# Altium project MiniPTM.PrjPcb (part 1 of 4)
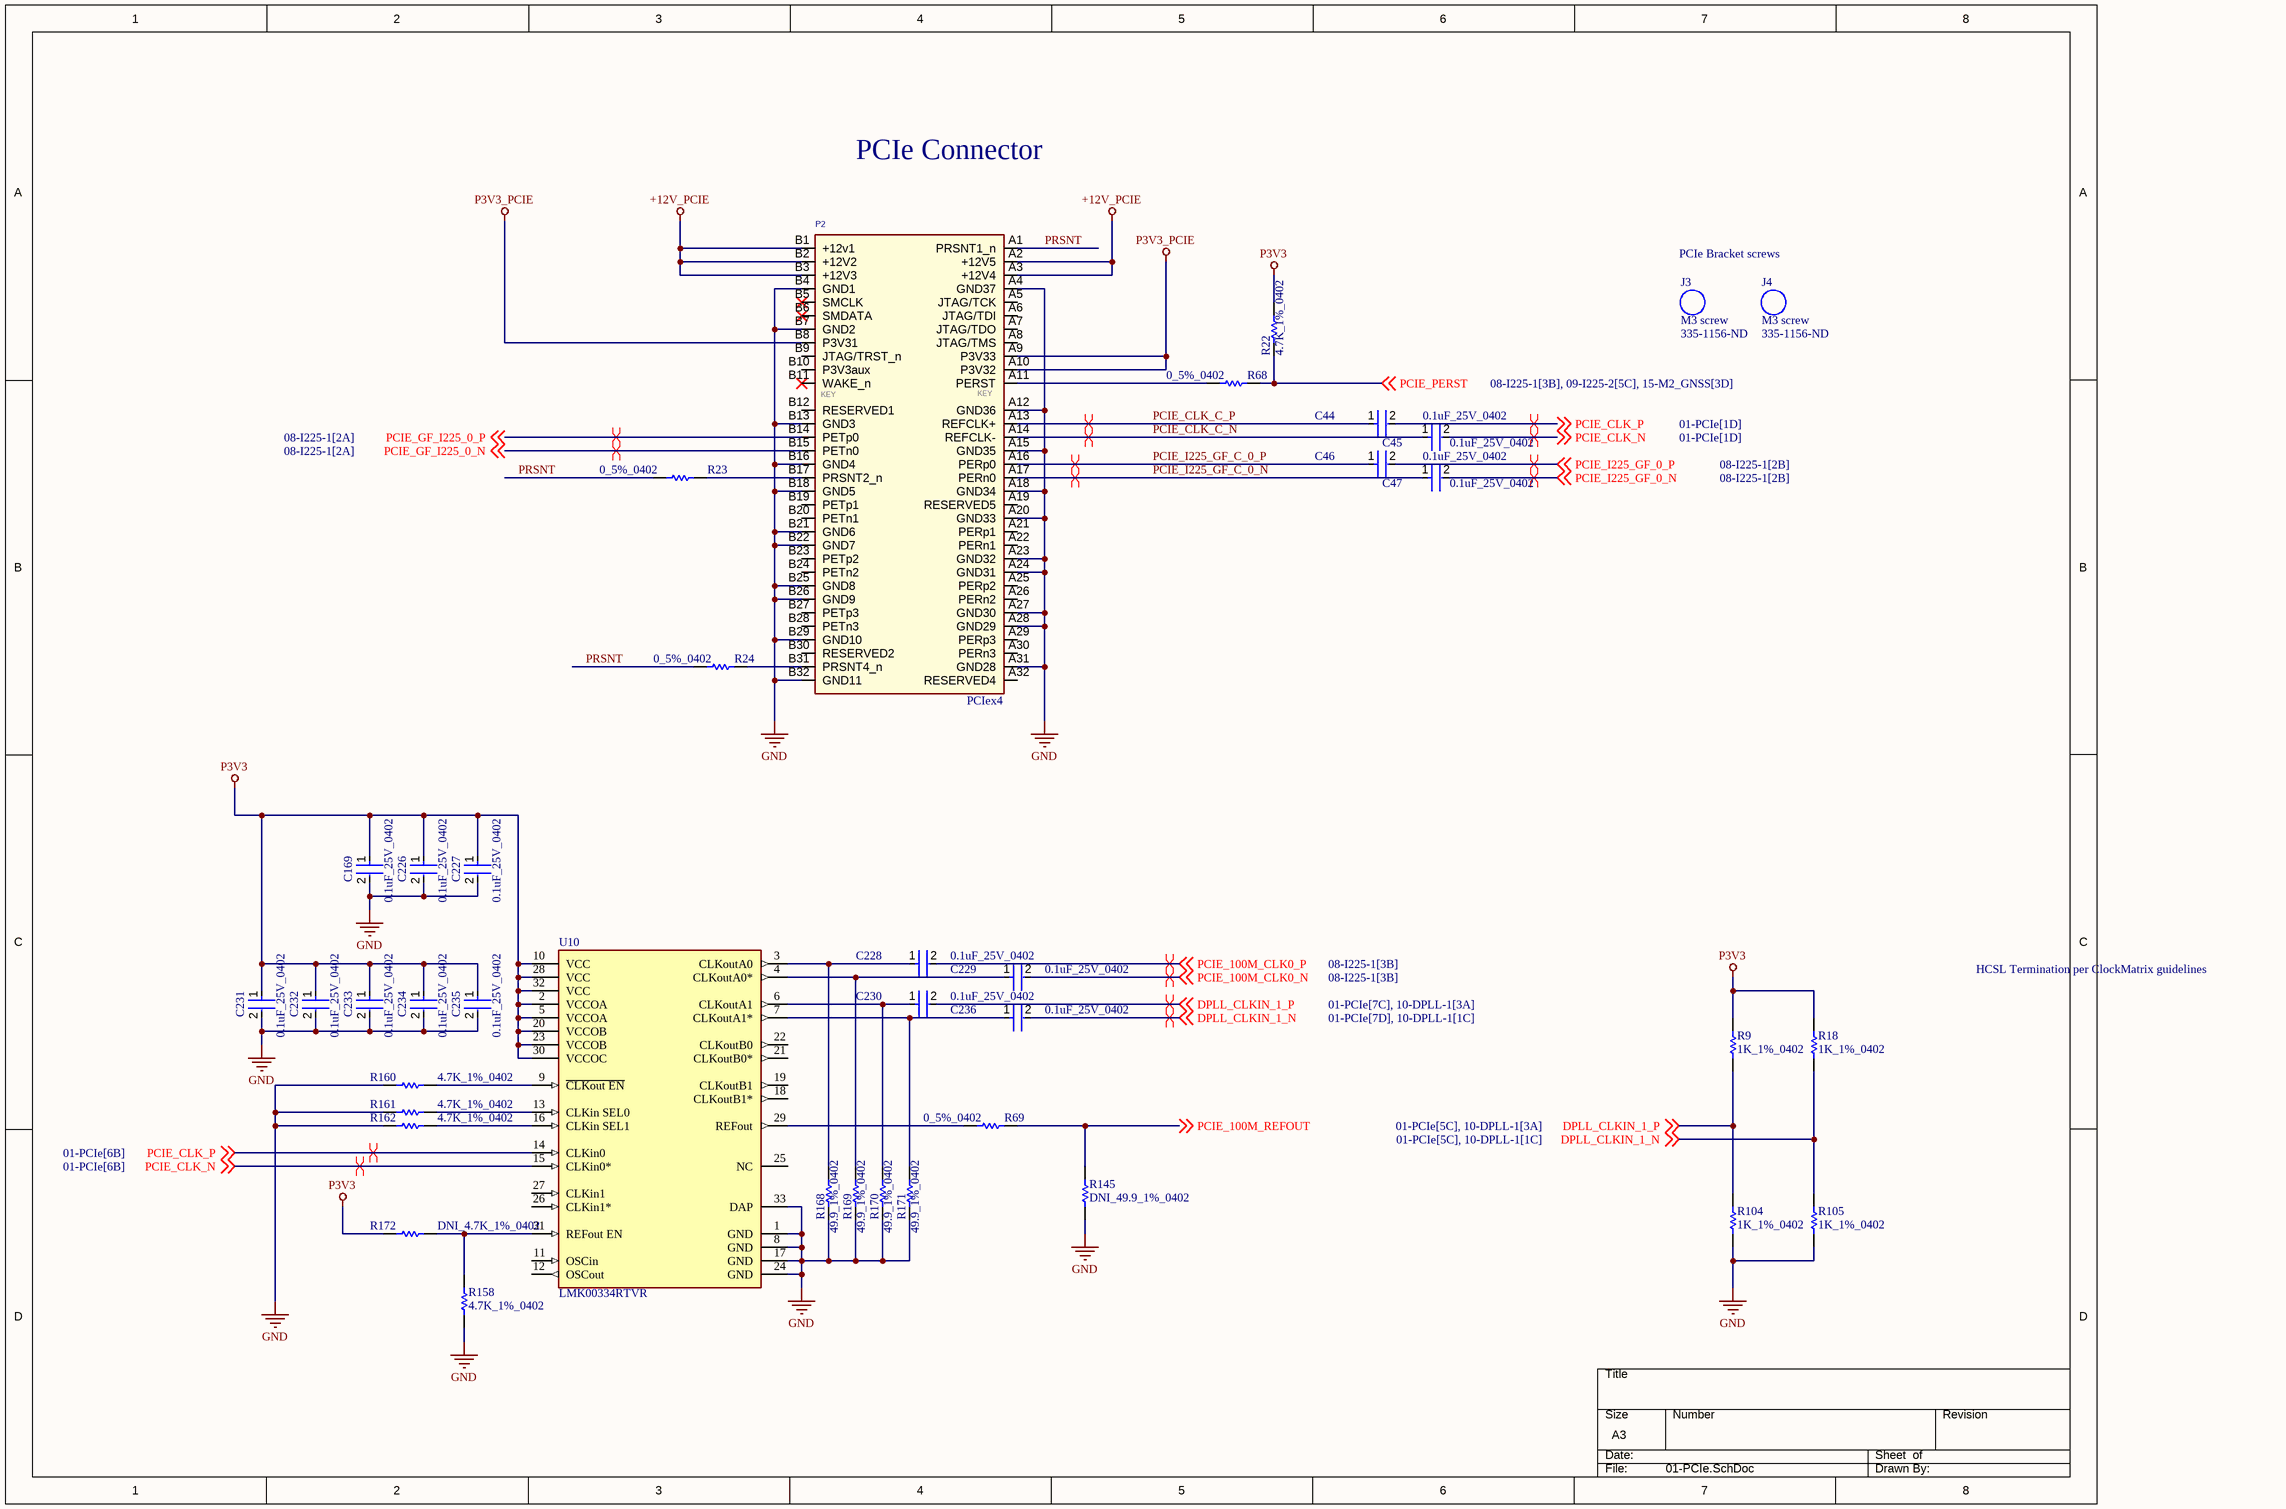
[diagram p0: 01-PCIe.SchDoc]
Revision: rev.1.0
15 sheets, 627 parts. Net scope: global (net labels, ports and power ports of the same name join across sheets).
Board file: MiniPTM.PcbDoc
Sheets:
  01-PCIe.SchDoc
  02-USER_IO.SchDoc
  03-USER_IO_STATUS.SchDoc
  05-Front Panel SFP_1.SchDoc
  06-Front Panel SFP_2.SchDoc
  07-General I2C Devices.SchDoc
  08-I225-1.SchDoc
  09-I225-2.SchDoc
  10-DPLL-1.SchDoc
  11-DPLL-2.SchDoc
  12-POWER-P12V.SchDoc
  13-Power-P3V3.SchDoc
  14-Power-P1V8.SchDoc
  15-M2_GNSS.SchDoc
  16-DPLL_Spare_UFL.SchDoc

## Sheet 01-PCIe.SchDoc
size A3; Customer: 01910; SheetNumber: 1; SheetTotal: 15

### Parts
C44  0.1uF_25V_0402  [FP-0402-L_1_0_1-W_0_5_0_1-IPC_C]
C45  0.1uF_25V_0402  [FP-0402-L_1_0_1-W_0_5_0_1-IPC_C]
C46  0.1uF_25V_0402  [FP-0402-L_1_0_1-W_0_5_0_1-IPC_C]
C47  0.1uF_25V_0402  [FP-0402-L_1_0_1-W_0_5_0_1-IPC_C]
C169  0.1uF_25V_0402  [FP-0402-L_1_0_1-W_0_5_0_1-IPC_C]
C226  0.1uF_25V_0402  [FP-0402-L_1_0_1-W_0_5_0_1-IPC_C]
C227  0.1uF_25V_0402  [FP-0402-L_1_0_1-W_0_5_0_1-IPC_C]
C228  0.1uF_25V_0402  [FP-0402-L_1_0_1-W_0_5_0_1-IPC_C]
C229  0.1uF_25V_0402  [FP-0402-L_1_0_1-W_0_5_0_1-IPC_C]
C230  0.1uF_25V_0402  [FP-0402-L_1_0_1-W_0_5_0_1-IPC_C]
C231  0.1uF_25V_0402  [FP-0402-L_1_0_1-W_0_5_0_1-IPC_C]
C232  0.1uF_25V_0402  [FP-0402-L_1_0_1-W_0_5_0_1-IPC_C]
C233  0.1uF_25V_0402  [FP-0402-L_1_0_1-W_0_5_0_1-IPC_C]
C234  0.1uF_25V_0402  [FP-0402-L_1_0_1-W_0_5_0_1-IPC_C]
C235  0.1uF_25V_0402  [FP-0402-L_1_0_1-W_0_5_0_1-IPC_C]
C236  0.1uF_25V_0402  [FP-0402-L_1_0_1-W_0_5_0_1-IPC_C]
J3  M3 screw  Supplier Part Number 1: 335-1156-ND  (no BOM)
J4  M3 screw  Supplier Part Number 1: 335-1156-ND  (no BOM)
P2  PCIex4  [PCIE_4LANE_EDGE]  (no BOM)
R9  1K_1%_0402  [RESC1005X40X25NL05T05]
R18  1K_1%_0402  [RESC1005X40X25NL05T05]
R22  4.7K_1%_0402  [RESC1005X40X25NL10T10]
R23  0_5%_0402  [RESC1005X40X25LL10T10]
R24  0_5%_0402  [RESC1005X40X25LL10T10]
R68  0_5%_0402  [RESC1005X40X25LL10T10]
R69  0_5%_0402  [RESC1005X40X25LL10T10]
R104  1K_1%_0402  [RESC1005X40X25NL05T05]
R105  1K_1%_0402  [RESC1005X40X25NL05T05]
R145  DNI_49.9_1%_0402  [RESC1005X40X25NL10T10]  (no BOM)
R158  4.7K_1%_0402  [RESC1005X40X25NL10T10]
R160  4.7K_1%_0402  [RESC1005X40X25NL10T10]
R161  4.7K_1%_0402  [RESC1005X40X25NL10T10]
R162  4.7K_1%_0402  [RESC1005X40X25NL10T10]
R168  49.9_1%_0402  [RESC1005X40X25NL10T10]
R169  49.9_1%_0402  [RESC1005X40X25NL10T10]
R170  49.9_1%_0402  [RESC1005X40X25NL10T10]
R171  49.9_1%_0402  [RESC1005X40X25NL10T10]
R172  DNI_4.7K_1%_0402  [RESC1005X40X25NL10T10]  (no BOM)
U10  LMK00334RTVR  [FP-RTV0032A-MFG]

### Nets
+12V_PCIE: P2.A2(+12V5) P2.A3(+12V4) P2.B1(+12v1) P2.B2(+12V2) P2.B3(+12V3)
GND: C169.2 C226.2 C227.2 C231.2 C232.2 C233.2 C234.2 C235.2 P2.A4(GND37) P2.A12(GND36) P2.A15(GND35) P2.A18(GND34) P2.A20(GND33) P2.A23(GND32) P2.A24(GND31) P2.A27(GND30) P2.A28(GND29) P2.A31(GND28) P2.B4(GND1) P2.B7(GND2) P2.B13(GND3) P2.B16(GND4) P2.B18(GND5) P2.B21(GND6) P2.B22(GND7) P2.B25(GND8) P2.B26(GND9) P2.B29(GND10) P2.B32(GND11) R104.1 R105.1 R145.2 R158.2 R160.2 R161.2 R162.2 R168.1 R169.1 R170.1 R171.1 U10.1(GND) U10.8(GND) U10.17(GND) U10.24(GND) U10.33(DAP)
P3V3: C169.1 C226.1 C227.1 C231.1 C232.1 C233.1 C234.1 C235.1 R9.2 R18.2 R22.2 R172.2 U10.2(VCCOA) U10.5(VCCOA) U10.10(VCC) U10.20(VCCOB) U10.23(VCCOB) U10.28(VCC) U10.30(VCCOC) U10.32(VCC)
P3V3_PCIE: P2.A9(P3V33) P2.A10(P3V32) P2.B8(P3V31)
DPLL_CLKIN_1_N: C236.2 R18.1 R105.2 ; off-sheet DPLL_CLKIN_1_N
DPLL_CLKIN_1_P: C230.2 R9.1 R104.2 ; off-sheet DPLL_CLKIN_1_P
PCIE_100M_CLK0_N: C229.2 ; off-sheet PCIE_100M_CLK0_N
PCIE_100M_CLK0_P: C228.2 ; off-sheet PCIE_100M_CLK0_P
PCIE_100M_REFOUT: R69.2 R145.1 ; off-sheet PCIE_100M_REFOUT
PCIE_CLK_C_N: C45.1 P2.A14(REFCLK-)
PCIE_CLK_C_P: C44.1 P2.A13(REFCLK+)
PCIE_CLK_N: C45.2 U10.15(CLKin0*) ; off-sheet PCIE_CLK_N
PCIE_CLK_P: C44.2 U10.14(CLKin0) ; off-sheet PCIE_CLK_P
PCIE_GF_I225_0_N: P2.B15(PETn0) ; off-sheet PCIE_GF_I225_0_N
PCIE_GF_I225_0_P: P2.B14(PETp0) ; off-sheet PCIE_GF_I225_0_P
PCIE_I225_GF_0_N: C47.2 ; off-sheet PCIE_I225_GF_0_N
PCIE_I225_GF_0_P: C46.2 ; off-sheet PCIE_I225_GF_0_P
PCIE_I225_GF_C_0_N: C47.1 P2.A17(PERn0)
PCIE_I225_GF_C_0_P: C46.1 P2.A16(PERp0)
PCIE_PERST: R22.1 R68.2 ; off-sheet PCIE_PERST
PRSNT: P2.A1(PRSNT1_n) R23.1 R24.1
NetC228_1: C228.1 R168.2 U10.3(CLKoutA0)
NetC229_1: C229.1 R169.2 U10.4(CLKoutA0*)
NetC230_1: C230.1 R170.2 U10.6(CLKoutA1)
NetC236_1: C236.1 R171.2 U10.7(CLKoutA1*)
NetP2_A11: P2.A11(PERST) R68.1
NetP2_B17: P2.B17(PRSNT2_n) R23.2
NetP2_B31: P2.B31(PRSNT4_n) R24.2
NetR69_1: R69.1 U10.29(REFout)
NetR158_1: R158.1 R172.1 U10.31(REFout_EN)
NetR160_1: R160.1 U10.9(~{CLKout_EN})
NetR161_1: R161.1 U10.13(CLKin_SEL0)
NetR162_1: R162.1 U10.16(CLKin_SEL1)

Not connected (* = marked no-connect by the designer): P2 A5(JTAG/TCK) A6(JTAG/TDI) A7(JTAG/TDO) A8(JTAG/TMS) A19(RESERVED5) A21(PERp1) A22(PERn1) A25(PERp2) A26(PERn2) A29(PERp3) A30(PERn3) A32(RESERVED4) B5(SMCLK)* B6(SMDATA)* B9(JTAG/TRST_n) B10(P3V3aux) B11(WAKE_n)* B12(RESERVED1) B19(PETp1) B20(PETn1) B23(PETp2) B24(PETn2) B27(PETp3) B28(PETn3) B30(RESERVED2); U10 11(OSCin) 12(OSCout) 18(CLKoutB1*) 19(CLKoutB1) 21(CLKoutB0*) 22(CLKoutB0) 25(NC) 26(CLKin1*) 27(CLKin1)

### Layout directives
differential pair: DPLL_CLKIN_1_N, DPLL_CLKIN_1_P, PCIE_100M_CLK0_N, PCIE_100M_CLK0_P, PCIE_CLK_C_N, PCIE_CLK_C_P, PCIE_CLK_N, PCIE_CLK_P, PCIE_GF_I225_0_N, PCIE_GF_I225_0_P, PCIE_I225_GF_0_N, PCIE_I225_GF_0_P, PCIE_I225_GF_C_0_N, PCIE_I225_GF_C_0_P

### Notes on the sheet
- PCIe Connector
- PCIe Bracket screws
- HCSL Termination per ClockMatrix guidelines
- SHEET
- REV
- timingcard.com <http://timingcard.com>
- DATE
- OF
- (in symbol PCIex4) KEY

### Library data of the parts
C44-C47 C169 C226-C236 = CMP-2008-02519-2: General Purpose Ceramic Capacitor, 0402, 100nF, 10%, X7R, 15%, 25V; Package Quantity: 1; Capacitance: 100nF; Min Operating Temperature: -55°C; Voltage: 25V; Voltage Rating: 25V; Construction: Flat; Max Operating Temperature: 125°C; Radiation Hardening: No; Depth: 0.5mm; Thickness: 0.022inch; Voltage Rating (DC): 25V; Number of Pins: 2; Lead Free: Lead Free; Series: -; REACH SVHC: No SVHC; Length: 1mm; Dielectric: X7R; RoHS Compliant: Yes; Mount: Surface Mount; Packaging: Tape and Reel; Case/Package: 0402; Case Code (Imperial): 0402; Termination: SMD/SMT; Width: 0.02inch; Case Code (Metric): 1005; Tolerance: 10%
P2 = PCIex4: PCIE x4 Edge Connector,OrCAD Symbol,NC; Part Number: 451; Manufacturer: NA; NOTE: NC; Vendor P/N: NA; Part Type: SMT
R9 R18 R104 R105 = CMP-2002-08277-1: Manufacturer: Vishay Dale; Part Number: CRCW04021K00FKTD
R22 R158 R160-R162 R172 = CMP-2002-05217-1: Manufacturer: Bourns; Part Number: CR0402-FX-4701GLF
R23 R24 R68 R69 = CMP-2002-04569-1: Manufacturer: KOA Speer; Part Number: RK73Z1ETTP
R145 R168-R171 = CMP-2002-04448-1: Part Number: RK73H1ETTP49R9F; Manufacturer: KOA Speer
U10 = CMP-04855-000011-1: IC CLK BUF 400MHZ 1CIRC 32WQFN; Number of Outputs: 4; Max Supply Voltage: 3.45V; PLL: No; Max Duty Cycle: 55%; Operating Supply Current: 13.5mA; Min Supply Voltage: 3.15V; Nominal Supply Current: 8.5mA; Input: Crystal; Propagation Delay: 2700ps; Operating Supply Voltage: 3.3V; Number of Circuits: 1; REACH SVHC: No SVHC; Radiation Hardening: No; RoHS Compliant: Yes; Lead Free: Lead Free; Mount: Surface Mount; Min Operating Temperature: -40°C; Package Quantity: 1000; Max Operating Temperature: 85°C; Number of Pins: 32; Max Frequency: 400MHz; Frequency: 400MHz; Packaging: Tape and Reel
J3 J4 = M3 screw: Supplier 1: Digi-Key

## Sheet 02-USER_IO.SchDoc
size A3; DocumentNumber: 1; SheetNumber: 2; SheetTotal: 15
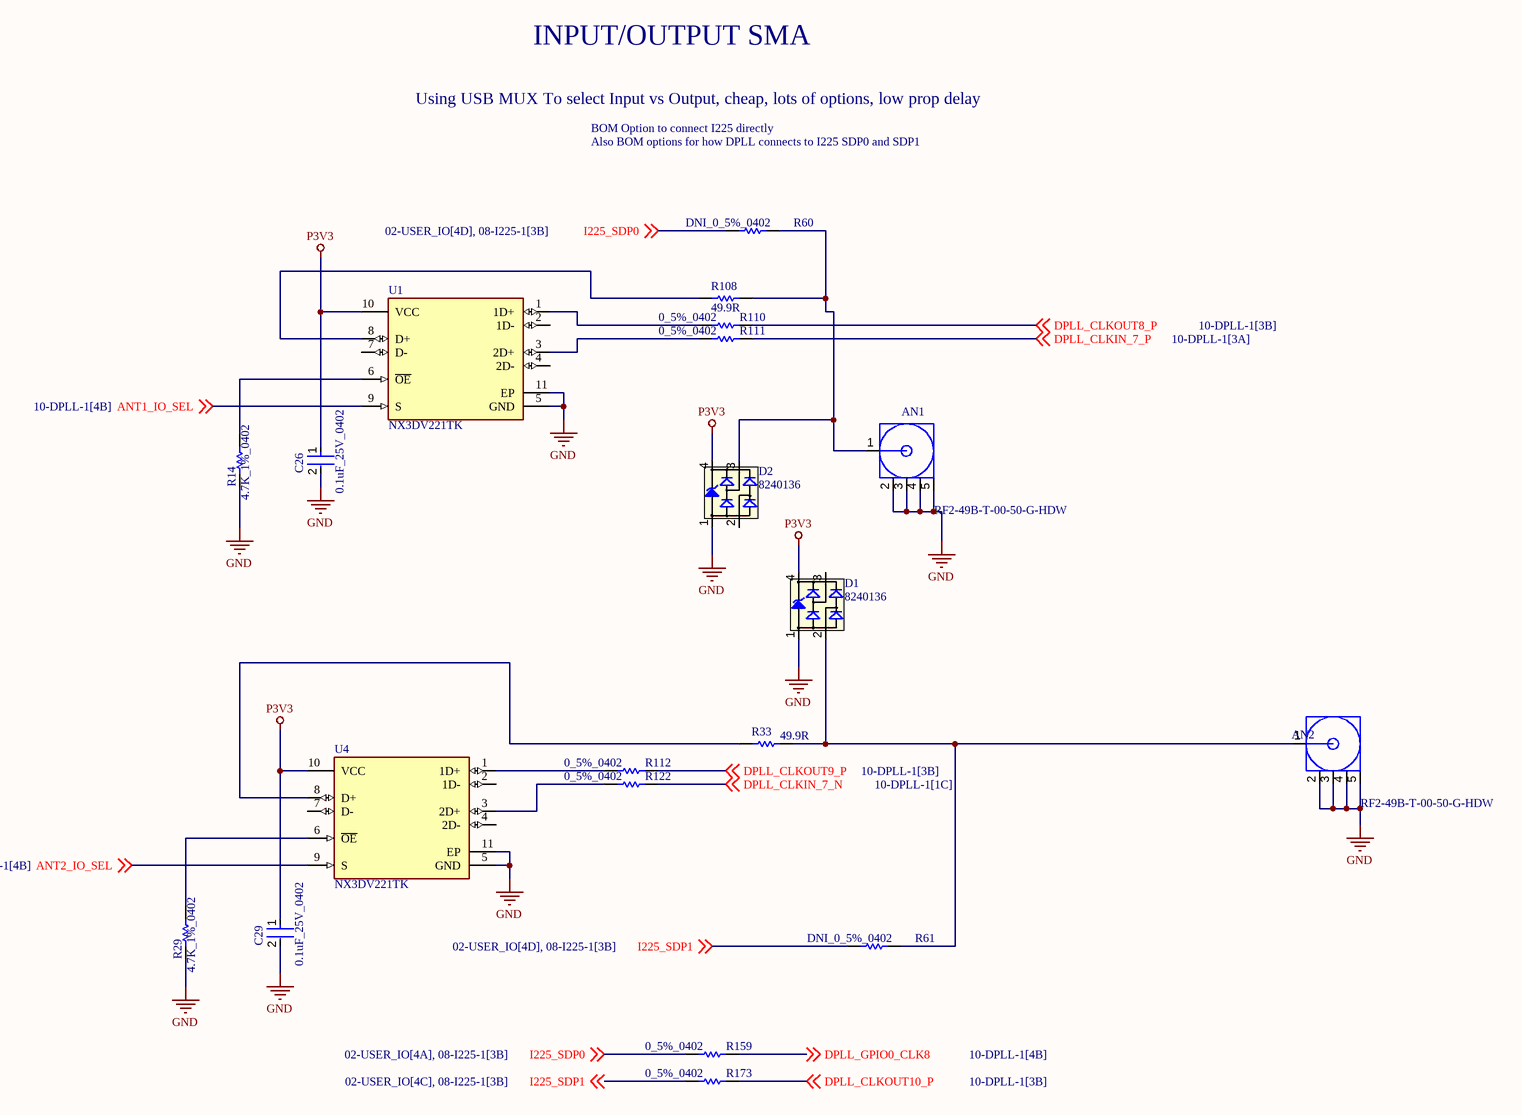
[diagram p1: 02-USER_IO.SchDoc]

### Parts
AN1  RF2-49B-T-00-50-G-HDW  [RF249BT0050GHDW]
AN2  RF2-49B-T-00-50-G-HDW  [RF249BT0050GHDW]
C26  0.1uF_25V_0402  [FP-0402-L_1_0_1-W_0_5_0_1-IPC_C]
C29  0.1uF_25V_0402  [FP-0402-L_1_0_1-W_0_5_0_1-IPC_C]
D1  8240136  [SOT143-4L]
D2  8240136  [SOT143-4L]
R14  4.7K_1%_0402  [RESC1005X40X25NL10T10]
R29  4.7K_1%_0402  [RESC1005X40X25NL10T10]
R33  49.9R  [RESC1608X55X25NL10T15]
R60  DNI_0_5%_0402  [RESC1005X40X25LL10T10]  (no BOM)
R61  DNI_0_5%_0402  [RESC1005X40X25LL10T10]  (no BOM)
R108  49.9R  [RESC1608X55X25NL10T15]
R110  0_5%_0402  [RESC1005X40X25LL10T10]
R111  0_5%_0402  [RESC1005X40X25LL10T10]
R112  0_5%_0402  [RESC1005X40X25LL10T10]
R122  0_5%_0402  [RESC1005X40X25LL10T10]
R159  0_5%_0402  [RESC1005X40X25LL10T10]
R173  0_5%_0402  [RESC1005X40X25LL10T10]
U1  NX3DV221TK  [FP-SOT650-2-MFG]
U4  NX3DV221TK  [FP-SOT650-2-MFG]

### Nets
GND: AN1.2 AN1.3 AN1.4 AN1.5 AN2.2 AN2.3 AN2.4 AN2.5 C26.2 C29.2 D1.1(GND) D2.1(GND) R14.2 R29.2 U1.5(GND) U1.11(EP) U4.5(GND) U4.11(EP)
P3V3: C26.1 C29.1 D1.4(VDD) D2.4(VDD) U1.10(VCC) U4.10(VCC)
ANT1_IO_SEL: U1.9(S) ; off-sheet ANT1_IO_SEL
ANT2_IO_SEL: U4.9(S) ; off-sheet ANT2_IO_SEL
DPLL_CLKIN_7_N: R122.2 ; off-sheet DPLL_CLKIN_7_N
DPLL_CLKIN_7_P: R111.2 ; off-sheet DPLL_CLKIN_7_P
DPLL_CLKOUT8_P: R110.2 ; off-sheet DPLL_CLKOUT8_P
DPLL_CLKOUT9_P: R112.2 ; off-sheet DPLL_CLKOUT9_P
DPLL_CLKOUT10_P: R173.2 ; off-sheet DPLL_CLKOUT10_P
DPLL_GPIO0_CLK8: R159.2 ; off-sheet DPLL_GPIO0_CLK8
I225_SDP0: R60.1 R159.1 ; off-sheet I225_SDP0
I225_SDP1: R61.1 R173.1 ; off-sheet I225_SDP1
NetAN1_1: AN1.1 D2.3(I/O2) R60.2 R108.1
NetAN2_1: AN2.1 D1.2(I/O1) R33.2 R61.2
NetR14_1: R14.1 U1.6(~{OE})
NetR29_1: R29.1 U4.6(~{OE})
NetR33_1: R33.1 U4.8(D+)
NetR108_2: R108.2 U1.8(D+)
NetR110_1: R110.1 U1.1(1D+)
NetR111_1: R111.1 U1.3(2D+)
NetR112_1: R112.1 U4.1(1D+)
NetR122_1: R122.1 U4.3(2D+)

Not connected (* = marked no-connect by the designer): D1 3(I/O2); D2 2(I/O1); U1 2(1D-) 4(2D-) 7(D-); U4 2(1D-) 4(2D-) 7(D-)

### Notes on the sheet
- Using USB MUX To select Input vs Output, cheap, lots of options, low prop delay
- INPUT/OUTPUT SMA
- BOM Option to connect I225 directly
- Also BOM options for how DPLL connects to I225 SDP0 and SDP1
- SHEET
- REV
- timingcard.com <http://timingcard.com>
- DATE
- OF

### Library data of the parts
AN1 AN2 = RF2-49B-T-00-50-G-HDW: Connector; Manufacturer_Name: Adam Tech; Datasheet Link: https://www.digikey.com/en/products/detail/adam-tech/RF2-49B-T-00-50-G-HDW/9831420?msockid=3e3afa68a50969ca3057ef1ca4c9684b; Height: 10.958mm; Manufacturer_Part_Number: RF2-49B-T-00-50-G-HDW; Arrow Part Number: RF2-49B-T-00-50-G-HDW; Arrow Price/Stock: https://www.arrow.com/en/products/rf2-49b-t-00-50-g-hdw/adam-tech?region=nac
C26 C29 = CMP-2008-02519-2: as C44 on sheet 01-PCIe; Package Quantity: 1; Capacitance: 100nF; Min Operating Temperature: -55°C; Voltage: 25V; Voltage Rating: 25V; Construction: Flat; Max Operating Temperature: 125°C; Radiation Hardening: No; Depth: 0.5mm; Thickness: 0.022inch; Voltage Rating (DC): 25V; Number of Pins: 2; Lead Free: Lead Free; Series: -; REACH SVHC: No SVHC; Length: 1mm; Dielectric: X7R; RoHS Compliant: Yes; Mount: Surface Mount; Packaging: Tape and Reel; Case/Package: 0402; Case Code (Imperial): 0402; Termination: SMD/SMT; Width: 0.02inch; Case Code (Metric): 1005; Tolerance: 10%
D1 D2 = CMP-1486-00002-1: TVS Diode WE-TVS-HS, VRWM=3.3V; Manufacturer: Wuerth Elektronik; Reverse Stand Off Voltage: 3.3V; PartNumber: 8240136; ComponentLink1Description: Manufacturer URL; PackageReference: SOT143-4L; ComponentLink1URL: http://www.we-online.com; ComponentLink2Description: Datasheet; ComponentLink2URL: http://katalog.we-online.de/kataloge/eisos/media/pdf/8240136.pdf
R14 R29 = CMP-2002-05217-1: as R22 on sheet 01-PCIe
R33 R108 = CMP-1659-00036-1: General Purpose Chip Resistor, 49.9 Ohm, +/- 1%, -55 to 155 degC, 0603 (1608 Metric), RoHS, Tape and Reel; Max Supply Voltage: 3.63 V; Case\Package: LQFP; Interface: SPI; Min Supply Voltage: 2.97 V; PackageReference: 0603; Packaging: Tray; ComponentLink2Description: Datasheet; ComponentLink1Description: Manufacturer URL; ComponentLink2URL: https://datasheet.ciiva.com/11808/0900766b80f96399-11808223.pdf; RoHSCompliant: true; Max Operating Temperature: 85 degC; ComponentLink1URL: http://www.yageo.com/; PackageDescription: 2-Pin Surface Mount Device, Body 1.6 x 0.8 mm; DatasheetVersion: Rev. 4, 04/2009; Min Operating Temperature: -40 degC; Package Quantity: 250; Pins: 48
R60 R61 R110-R112 R122 R159 R173 = CMP-2002-04569-1: as R23 on sheet 01-PCIe
U1 U4 = CMP-10103-000005-1: USB Switch IC 1 Channel 10-HVSON (3x3); RoHS Compliant: Yes

## Sheet 03-USER_IO_STATUS.SchDoc: Time Card
size A4; SheetNumber: 3; SheetTotal: 15; ENG_APP_DATE: --/--/--; DSN_APP_DATE: --/--/--; CHK_APP_DATE: --/--/--
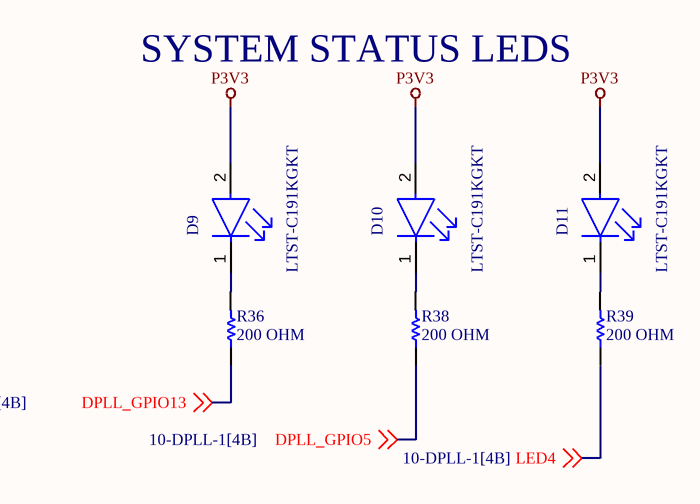
[diagram p2: 03-USER_IO_STATUS.SchDoc]

### Parts
D9  LTST-C191KGKT  [FP-LTST-C191KGKT-MFG]
D10  LTST-C191KGKT  [FP-LTST-C191KGKT-MFG]
D11  LTST-C191KGKT  [FP-LTST-C191KGKT-MFG]
R36  200 OHM  [RESC1608X55X30NL15T15]
R38  200 OHM  [RESC1608X55X30NL15T15]
R39  200 OHM  [RESC1608X55X30NL15T15]

### Nets
P3V3: D9.2(A) D10.2(A) D11.2(A)
DPLL_GPIO5: R38.1 ; off-sheet DPLL_GPIO5
DPLL_GPIO13: R36.1 ; off-sheet DPLL_GPIO13
LED4: R39.1 ; off-sheet LED4
NetD9_1: D9.1(C) R36.2
NetD10_1: D10.1(C) R38.2
NetD11_1: D11.1(C) R39.2

### Notes on the sheet
- SYSTEM STATUS LEDS
- DWG. NO.
- REV.
- SHT.
- THIS DOCUMENT AND THE DATA DISCLOSED HEREIN OR HEREWITH IS THE PROPERTY OF ALTIUM LIMITED AND MAY BE FREELY DISTRIBUTED IN WHOLE. NO RIGHTS ARE RESERVED OR EXPRESS OR IMPLIED WARANTEE GIVEN.
- REVISION
- DESCRIPTION
- DATE
- APPROVED
- ENG:
- APPROVALS
- PROJECT
- DSN:
- CHK:
- REFERENCE DOCUMENTS
- PROJECT REVISION:
- TITLE
- DOCUMENT REVISION:
- DESIGN ITEM:
- BOM:
- FAB DWG:
- PCB DWG:
- ASSY DWG:
- SCALE:
- SIZE
- B
- CAGE CODE
- FILE NAME
- DWG NO.
- SHEET
- OF
- REV

### Library data of the parts
D9-D11 = CMP-2000-05198-2: LED GREEN CLEAR SMD; Max Power Dissipation: 75mW; Forward Current: 30mA; Reverse Voltage: 5V; Lens Color: Colorless; Forward Voltage: 2V; Dominant Wavelength: 571nm; Number of LEDs: 1; Viewing Angle: 130°; Lens Style: Rectangular; Test Current: 20mA; Luminous Intensity: 35mcd; Wavelength: 574nm; Width: 0.8mm; Case Code (Imperial): 0603; Number of Pins: 2; Lead Free: Lead Free; Packaging: Tape and Reel; Package Quantity: 1; Min Operating Temperature: -55°C; Case/Package: 0603; Length: 1.6mm; Power Dissipation: 75mW; Depth: 0.8mm; Radiation Hardening: No; Mount: Surface Mount; Max Operating Temperature: 85°C; Color: Green; Power Rating: 75mW; Height: 0.55mm; Illumination Color: Green; Case Code (Metric): 1608; Lens Transparency: Clear; Number of Elements: 1
R36 R38 R39 = CMP-2000-00316-1: ERJ-3EKF2000V; Manufacturer: Panasonic; Part Number: ERJ-3EKF2000V

## Sheet 05-Front Panel SFP_1.SchDoc
size A3; Customer: 01910; SheetNumber: 4; SheetTotal: 15
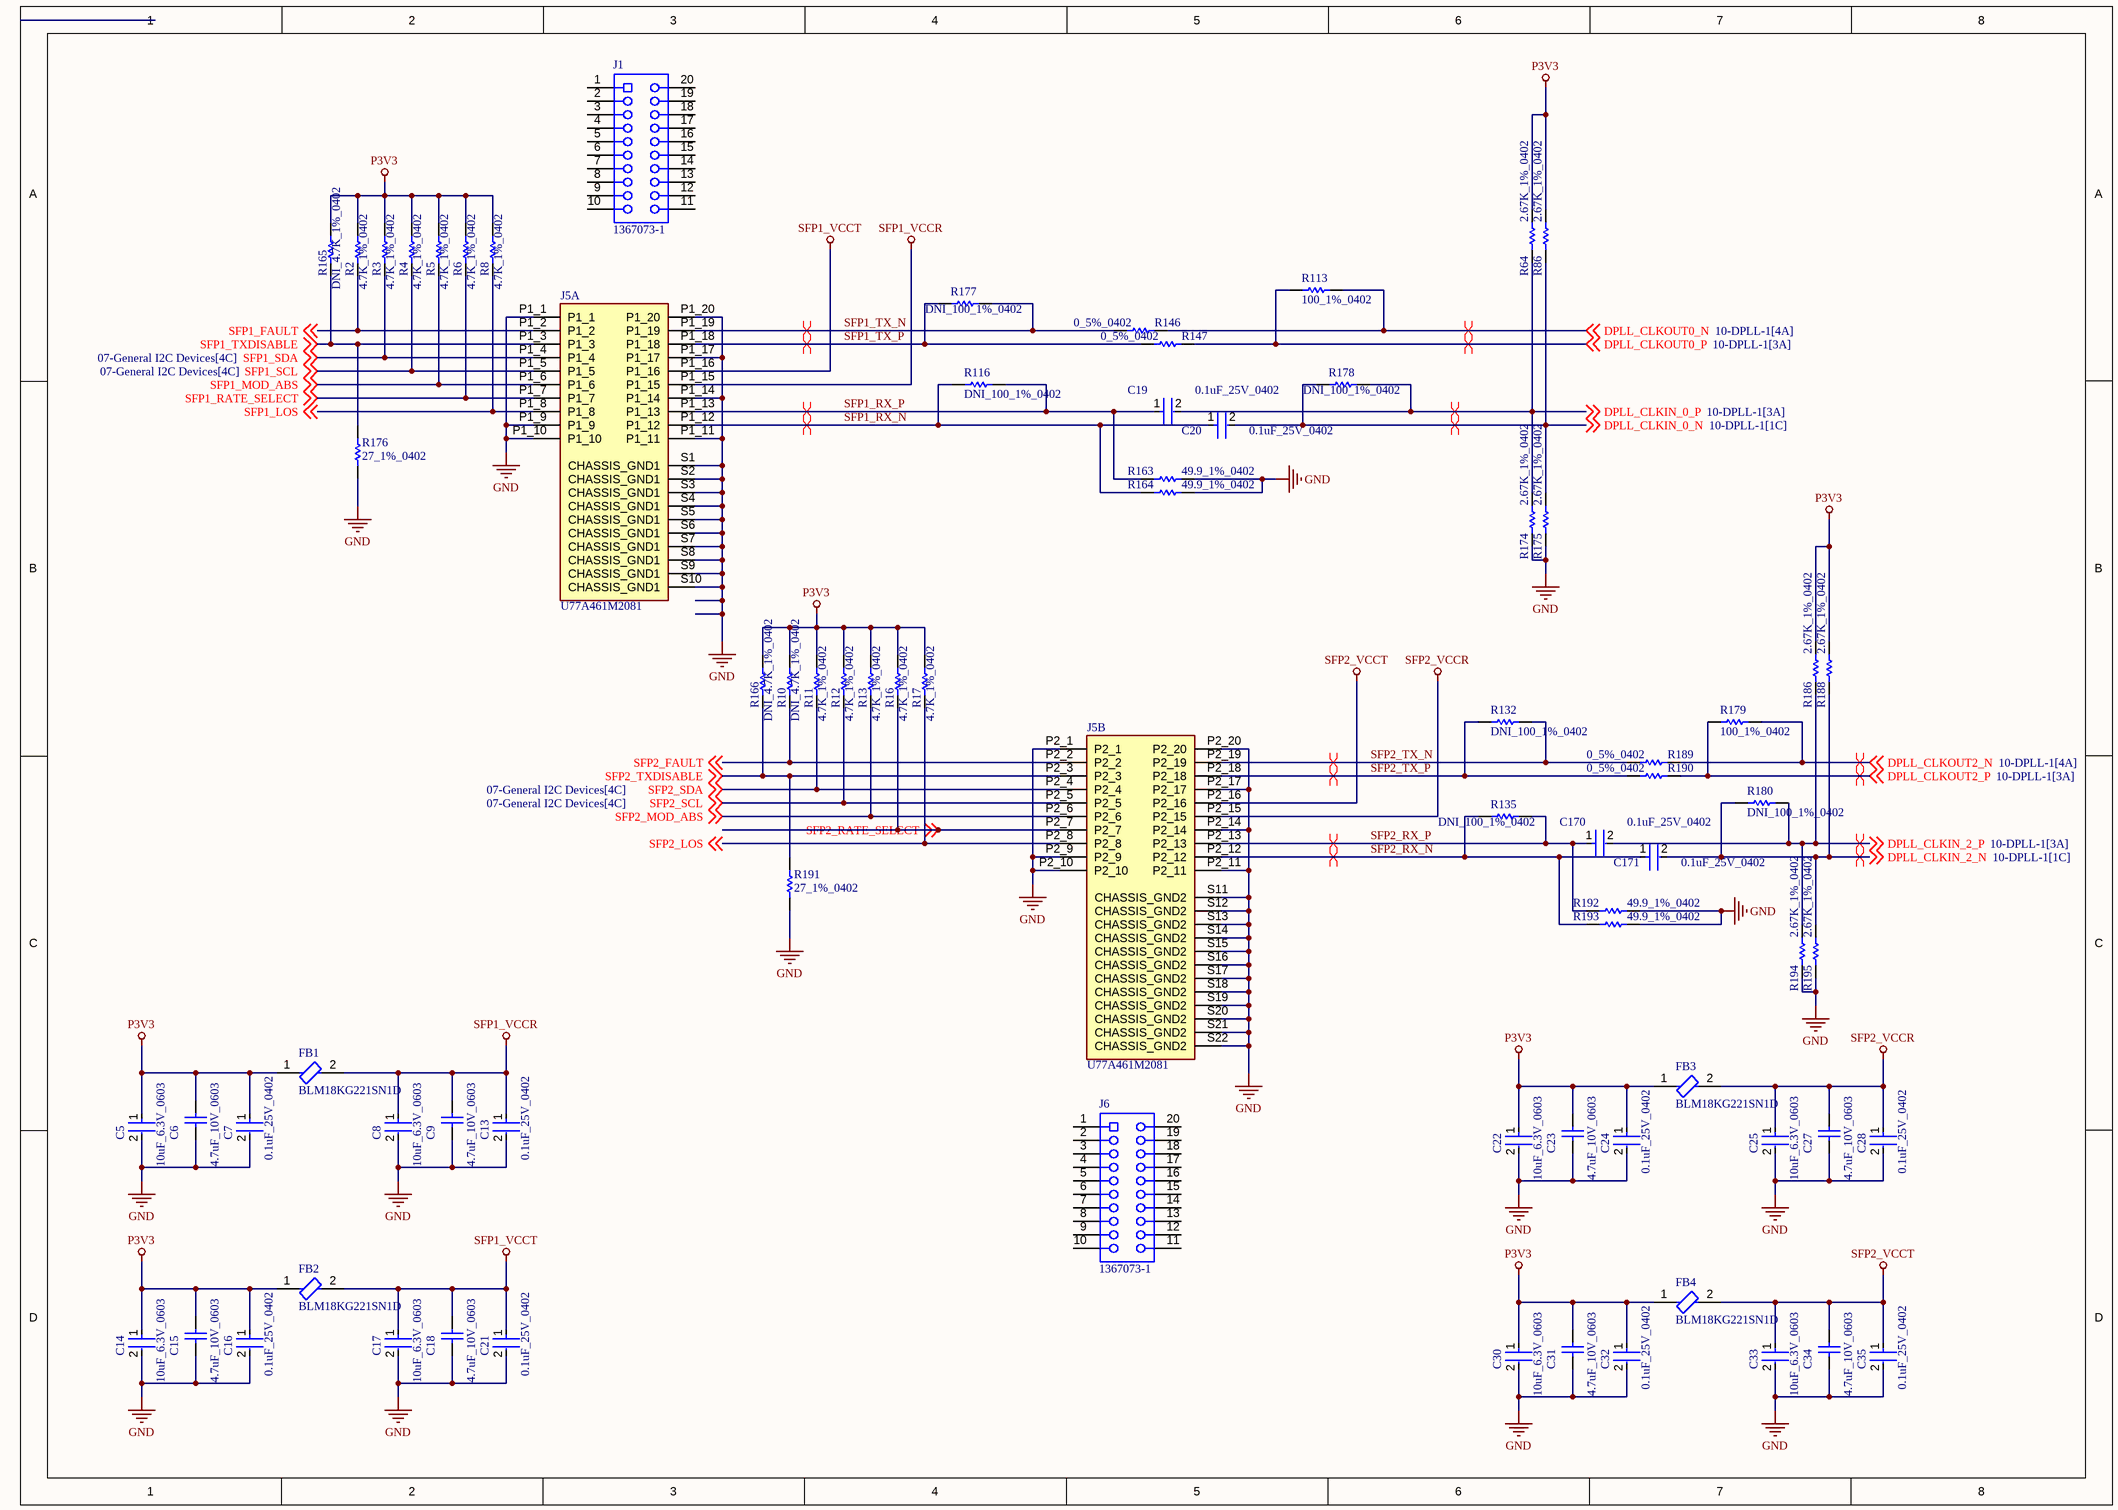
[diagram p3: 05-Front Panel SFP_1.SchDoc]

### Parts
C5  10uF_6.3V_0603  [FP-C0603C106M9PACTU-MFG]
C6  4.7uF_10V_0603  [CAPC1608X87X35NL15T15]
C7  0.1uF_25V_0402  [FP-0402-L_1_0_1-W_0_5_0_1-IPC_C]
C8  10uF_6.3V_0603  [FP-C0603C106M9PACTU-MFG]
C9  4.7uF_10V_0603  [CAPC1608X87X35NL15T15]
C13  0.1uF_25V_0402  [FP-0402-L_1_0_1-W_0_5_0_1-IPC_C]
C14  10uF_6.3V_0603  [FP-C0603C106M9PACTU-MFG]
C15  4.7uF_10V_0603  [CAPC1608X87X35NL15T15]
C16  0.1uF_25V_0402  [FP-0402-L_1_0_1-W_0_5_0_1-IPC_C]
C17  10uF_6.3V_0603  [FP-C0603C106M9PACTU-MFG]
C18  4.7uF_10V_0603  [CAPC1608X87X35NL15T15]
C19  0.1uF_25V_0402  [FP-0402-L_1_0_1-W_0_5_0_1-IPC_C]
C20  0.1uF_25V_0402  [FP-0402-L_1_0_1-W_0_5_0_1-IPC_C]
C21  0.1uF_25V_0402  [FP-0402-L_1_0_1-W_0_5_0_1-IPC_C]
C22  10uF_6.3V_0603  [FP-C0603C106M9PACTU-MFG]
C23  4.7uF_10V_0603  [CAPC1608X87X35NL15T15]
C24  0.1uF_25V_0402  [FP-0402-L_1_0_1-W_0_5_0_1-IPC_C]
C25  10uF_6.3V_0603  [FP-C0603C106M9PACTU-MFG]
C27  4.7uF_10V_0603  [CAPC1608X87X35NL15T15]
C28  0.1uF_25V_0402  [FP-0402-L_1_0_1-W_0_5_0_1-IPC_C]
C30  10uF_6.3V_0603  [FP-C0603C106M9PACTU-MFG]
C31  4.7uF_10V_0603  [CAPC1608X87X35NL15T15]
C32  0.1uF_25V_0402  [FP-0402-L_1_0_1-W_0_5_0_1-IPC_C]
C33  10uF_6.3V_0603  [FP-C0603C106M9PACTU-MFG]
C34  4.7uF_10V_0603  [CAPC1608X87X35NL15T15]
C35  0.1uF_25V_0402  [FP-0402-L_1_0_1-W_0_5_0_1-IPC_C]
C170  0.1uF_25V_0402  [FP-0402-L_1_0_1-W_0_5_0_1-IPC_C]
C171  0.1uF_25V_0402  [FP-0402-L_1_0_1-W_0_5_0_1-IPC_C]
FB1  BLM18KG221SN1D  [FP-BLM18-0_15-t0_8-IPC_B]
FB2  BLM18KG221SN1D  [FP-BLM18-0_15-t0_8-IPC_B]
FB3  BLM18KG221SN1D  [FP-BLM18-0_15-t0_8-IPC_B]
FB4  BLM18KG221SN1D  [FP-BLM18-0_15-t0_8-IPC_B]
J1  1367073-1  [TECO-1367073-1_V]
J5  U77A461M2081  [AMPHENOL_U77A461M2081]  (parts A,B of 4)
J6  1367073-1  [TECO-1367073-1_V]
R2  4.7K_1%_0402  [RESC1005X40X25NL10T10]
R3  4.7K_1%_0402  [RESC1005X40X25NL10T10]
R4  4.7K_1%_0402  [RESC1005X40X25NL10T10]
R5  4.7K_1%_0402  [RESC1005X40X25NL10T10]
R6  4.7K_1%_0402  [RESC1005X40X25NL10T10]
R8  4.7K_1%_0402  [RESC1005X40X25NL10T10]
R10  DNI_4.7K_1%_0402  [RESC1005X40X25NL10T10]  (no BOM)
R11  4.7K_1%_0402  [RESC1005X40X25NL10T10]
R12  4.7K_1%_0402  [RESC1005X40X25NL10T10]
R13  4.7K_1%_0402  [RESC1005X40X25NL10T10]
R16  4.7K_1%_0402  [RESC1005X40X25NL10T10]
R17  4.7K_1%_0402  [RESC1005X40X25NL10T10]
R64  2.67K_1%_0402  [RESC1005X40X25NL05T10]
R86  2.67K_1%_0402  [RESC1005X40X25NL05T10]
R113  100_1%_0402  [RESC1005X40X25NL05T10]
R116  DNI_100_1%_0402  [RESC1005X40X25NL05T10]  (no BOM)
R132  DNI_100_1%_0402  [RESC1005X40X25NL05T10]  (no BOM)
R135  DNI_100_1%_0402  [RESC1005X40X25NL05T10]  (no BOM)
R146  0_5%_0402  [RESC1005X40X25LL10T10]
R147  0_5%_0402  [RESC1005X40X25LL10T10]
R163  49.9_1%_0402  [RESC1005X40X25NL10T10]
R164  49.9_1%_0402  [RESC1005X40X25NL10T10]
R165  DNI_4.7K_1%_0402  [RESC1005X40X25NL10T10]  (no BOM)
R166  DNI_4.7K_1%_0402  [RESC1005X40X25NL10T10]  (no BOM)
R174  2.67K_1%_0402  [RESC1005X40X25NL05T10]
R175  2.67K_1%_0402  [RESC1005X40X25NL05T10]
R176  27_1%_0402  [RESC1005X40X25NL05T05]
R177  DNI_100_1%_0402  [RESC1005X40X25NL05T10]  (no BOM)
R178  DNI_100_1%_0402  [RESC1005X40X25NL05T10]  (no BOM)
R179  100_1%_0402  [RESC1005X40X25NL05T10]
R180  DNI_100_1%_0402  [RESC1005X40X25NL05T10]  (no BOM)
R186  2.67K_1%_0402  [RESC1005X40X25NL05T10]
R188  2.67K_1%_0402  [RESC1005X40X25NL05T10]
R189  0_5%_0402  [RESC1005X40X25LL10T10]
R190  0_5%_0402  [RESC1005X40X25LL10T10]
R191  27_1%_0402  [RESC1005X40X25NL05T05]
R192  49.9_1%_0402  [RESC1005X40X25NL10T10]
R193  49.9_1%_0402  [RESC1005X40X25NL10T10]
R194  2.67K_1%_0402  [RESC1005X40X25NL05T10]
R195  2.67K_1%_0402  [RESC1005X40X25NL05T10]

### Nets
GND: C5.2 C6.1 C7.2 C8.2 C9.1 C13.2 C14.2 C15.1 C16.2 C17.2 C18.1 C21.2 C22.2 C23.1 C24.2 C25.2 C27.1 C28.2 C30.2 C31.1 C32.2 C33.2 C34.1 C35.2 J5.P1_1 J5.P1_9 J5.P1_10 J5.P1_11 J5.P1_14 J5.P1_17 J5.P1_20 J5.P2_1 J5.P2_9 J5.P2_10 J5.P2_11 J5.P2_14 J5.P2_17 J5.P2_20 J5.S1(CHASSIS_GND1) J5.S2(CHASSIS_GND1) J5.S3(CHASSIS_GND1) J5.S4(CHASSIS_GND1) J5.S5(CHASSIS_GND1) J5.S6(CHASSIS_GND1) J5.S7(CHASSIS_GND1) J5.S8(CHASSIS_GND1) J5.S9(CHASSIS_GND1) J5.S10(CHASSIS_GND1) J5.S11(CHASSIS_GND2) J5.S12(CHASSIS_GND2) J5.S13(CHASSIS_GND2) J5.S14(CHASSIS_GND2) J5.S15(CHASSIS_GND2) J5.S16(CHASSIS_GND2) J5.S17(CHASSIS_GND2) J5.S18(CHASSIS_GND2) J5.S19(CHASSIS_GND2) J5.S20(CHASSIS_GND2) J5.S21(CHASSIS_GND2) J5.S22(CHASSIS_GND2) R163.2 R164.2 R174.1 R175.1 R176.1 R191.1 R192.2 R193.2 R194.1 R195.1
P3V3: C5.1 C6.2 C7.1 C14.1 C15.2 C16.1 C22.1 C23.2 C24.1 C30.1 C31.2 C32.1 FB1.1 FB2.1 FB3.1 FB4.1 R2.1 R3.1 R4.1 R5.1 R6.1 R8.1 R10.1 R11.1 R12.1 R13.1 R16.1 R17.1 R64.2 R86.2 R165.1 R166.1 R186.2 R188.2
SFP1_VCCR: C8.1 C9.2 C13.1 FB1.2 J5.P1_15
SFP1_VCCT: C17.1 C18.2 C21.1 FB2.2 J5.P1_16
SFP2_VCCR: C25.1 C27.2 C28.1 FB3.2 J5.P2_15
SFP2_VCCT: C33.1 C34.2 C35.1 FB4.2 J5.P2_16
DPLL_CLKIN_0_N: C20.2 R86.1 R175.2 R178.1 ; off-sheet DPLL_CLKIN_0_N
DPLL_CLKIN_0_P: C19.2 R64.1 R174.2 R178.2 ; off-sheet DPLL_CLKIN_0_P
DPLL_CLKIN_2_N: C171.2 R180.1 R188.1 R195.2 ; off-sheet DPLL_CLKIN_2_N
DPLL_CLKIN_2_P: C170.2 R180.2 R186.1 R194.2 ; off-sheet DPLL_CLKIN_2_P
DPLL_CLKOUT0_N: R113.2 R146.2 ; off-sheet DPLL_CLKOUT0_N
DPLL_CLKOUT0_P: R113.1 R147.2 ; off-sheet DPLL_CLKOUT0_P
DPLL_CLKOUT2_N: R179.2 R189.2 ; off-sheet DPLL_CLKOUT2_N
DPLL_CLKOUT2_P: R179.1 R190.2 ; off-sheet DPLL_CLKOUT2_P
SFP1_FAULT: J5.P1_2 R2.2 ; off-sheet SFP1_FAULT
SFP1_LOS: J5.P1_8 R8.2 ; off-sheet SFP1_LOS
SFP1_MOD_ABS: J5.P1_6 R5.2 ; off-sheet SFP1_MOD_ABS
SFP1_RATE_SELECT: J5.P1_7 R6.2 ; off-sheet SFP1_RATE_SELECT
SFP1_RX_N: C20.1 J5.P1_12 R116.1 R164.1
SFP1_RX_P: C19.1 J5.P1_13 R116.2 R163.1
SFP1_SCL: J5.P1_5 R4.2 ; off-sheet SFP1_SCL
SFP1_SDA: J5.P1_4 R3.2 ; off-sheet SFP1_SDA
SFP1_TX_N: J5.P1_19 R146.1 R177.2
SFP1_TX_P: J5.P1_18 R147.1 R177.1
SFP1_TXDISABLE: J5.P1_3 R165.2 R176.2 ; off-sheet SFP1_TXDISABLE
SFP2_FAULT: J5.P2_2 R10.2 ; off-sheet SFP2_FAULT
SFP2_LOS: J5.P2_8 R17.2 ; off-sheet SFP2_LOS
SFP2_MOD_ABS: J5.P2_6 R13.2 ; off-sheet SFP2_MOD_ABS
SFP2_RATE_SELECT: J5.P2_7 R16.2 ; off-sheet SFP2_RATE_SELECT
SFP2_RX_N: C171.1 J5.P2_12 R135.1 R193.1
SFP2_RX_P: C170.1 J5.P2_13 R135.2 R192.1
SFP2_SCL: J5.P2_5 R12.2 ; off-sheet SFP2_SCL
SFP2_SDA: J5.P2_4 R11.2 ; off-sheet SFP2_SDA
SFP2_TX_N: J5.P2_19 R132.2 R189.1
SFP2_TX_P: J5.P2_18 R132.1 R190.1
SFP2_TXDISABLE: J5.P2_3 R166.2 R191.2 ; off-sheet SFP2_TXDISABLE

Not connected (* = marked no-connect by the designer): J1 1 2 3 4 5 6 7 8 9 10 11 12 13 14 15 16 17 18 19 20; J6 1 2 3 4 5 6 7 8 9 10 11 12 13 14 15 16 17 18 19 20

### Layout directives
differential pair: DPLL_CLKIN_0_N, DPLL_CLKIN_0_P, DPLL_CLKIN_2_N, DPLL_CLKIN_2_P, DPLL_CLKOUT0_N, DPLL_CLKOUT0_P, DPLL_CLKOUT2_N, DPLL_CLKOUT2_P, SFP1_RX_N, SFP1_RX_P, SFP1_TX_N, SFP1_TX_P, SFP2_RX_N, SFP2_RX_P, SFP2_TX_N, SFP2_TX_P

### Notes on the sheet
- SHEET
- REV
- timingcard.com <http://timingcard.com>
- DATE
- OF

### Library data of the parts
C5 C8 C14 C17 C22 C25 C30 C33 = CMP-2006-02285-3: CAP CER 10UF 6.3V X5R 0603; Manufacturer Part Number: C0603C106M9PACTU; Manufacturer: Kemet; Material: Ceramic; Temperature Coefficient: 15%; Tolerance: 20%; Category: Cap; Height: 0.9mm; Digikey Description: CAP CER 10UF 6.3V X5R 0603; Mouser Description: In a Pack of 10, KEMET 0603 (1608M) 10µF MLCC 6.3V dc ±20% SMD C0603C106M9PACTU; Voltage Rating: 6.3V; Device Class L2: Capacitors; Temperature Range Low: -55°C; Temperature Characteristic: X5R; ComponentLink2Description: Datasheet; Ipc Land Pattern Name: CAPC16080X80; ComponentLink2URL: http://www.kemet.com/Lists/ProductCatalog/Attachments/19/KEM_C1006_X5R_SMD.pdf; Capacitance: 10uF; Temperature Range High: +85°C; Device Class L3: Ceramic Capacitors; RoHS: TRUE; Automotive: No; Value: 10uF; Temperature: -55°C to +85°C; Device Class L1: Passive Components; Package: C0603C106M9PACTU; Lead Free: Yes; Octopart: https://octopart.com/c0603c106m9pactu-kemet-8375727
C6 C9 C15 C18 C23 C27 C31 C34 = CMP-2006-03238-1: Part Number: C0603C475K8PACTU; Manufacturer: Kemet
C7 C13 C16 C19-C21 C24 C28 C32 C35 C170 C171 = CMP-2008-02519-2: as C44 on sheet 01-PCIe; Package Quantity: 1; Capacitance: 100nF; Min Operating Temperature: -55°C; Voltage: 25V; Voltage Rating: 25V; Construction: Flat; Max Operating Temperature: 125°C; Radiation Hardening: No; Depth: 0.5mm; Thickness: 0.022inch; Voltage Rating (DC): 25V; Number of Pins: 2; Lead Free: Lead Free; Series: -; REACH SVHC: No SVHC; Length: 1mm; Dielectric: X7R; RoHS Compliant: Yes; Mount: Surface Mount; Packaging: Tape and Reel; Case/Package: 0402; Case Code (Imperial): 0402; Termination: SMD/SMT; Width: 0.02inch; Case Code (Metric): 1005; Tolerance: 10%
FB1-FB4 = CMP-0686-00556-7: Chip Ferrite Bead, 0603, 220Ω @ 100MHz, 0.05Ω, 25%, 2.2A; DC Resistance (DCR): 50mR; Number of Circuits: 1; Impedance: 220R; Current Rating: 2.2A; Material: Ferrite; Test Frequency: 100MHz; Depth: 0.8mm; Series: BLM18K; RoHS Compliant: Yes; Termination: SMD/SMT; Max Current Rating: 2.2A; Case Code (Metric): 1608; Radiation Hardening: No; Number of Pins: 2; Length: 1.6mm; Lead Free: Lead Free; Package Quantity: 1; Height: 0.8mm; Core Material: Ferrite; Inductor Type: FERRITE BEAD; Min Operating Temperature: -55°C; Case/Package: 0603; Case Code (Imperial): 0603; Number of Lines: 1; Packaging: Tape and Reel; REACH SVHC: No SVHC; Max Operating Temperature: 125°C; Military Standard: Not; DC Resistance-Max: 50mR; Width: 0.8mm; DC Current: 2.2A; Max DC Current: 2.2A; Tolerance: 25%; Weight: 7.1E-05oz
J1 J6 = CMP-2000-05488-1: Female Connector, Pitch 0.8 mm, 2 x 10 Position, Height 5.4 mm, -55 to 85 degC, RoHS, Tape and Reel; Manufacturer: TE Connectivity; Product Training Modules: HighSpeedPluggableI/OSolutions; 3D Model: 1367073-1.pdf; Connector Type: SFP; Other Names: A97430DKR; Mating Products: 516-2084-ND / -TXRXOPTICALSFF1.25GBDISCSI; Dynamic Catalog: SFPConnectors; Featured Product: HighSpeedPluggableI-OSolutions; Connector Style: Receptacle; Associated Product: A103997CT-ND / -CONNSFPCAGESINGLEW/OPIPE / A103997TR-ND / -CONNSFPCAGESINGLEW/OPIPE / 1367645-3-ND / -CONNCAGE&HEATSINKSGLPORTTIN / 1367645-2-ND / -CONNCAGE&HEATSINKSGLPORTTIN / 1888424-1-ND / -CONNCAGE1X2SFPENHANCEDEMI / 1367643-1-ND / -CONNCAGESNGLPORTDBLSIDETIN / 1489962-1-ND / -CONNSFPCAGESINGLEW/OPIPE / 1367645-1-ND / -CONNCAGE&HEATSINKSGLPORTTIN / A99375-ND / -CONNSFPCAGE1X4PIN-IN-PASTE / A97412CT-ND / -CONNSFPLOWERCAGEPCB / More...; Number of Positions: 20; Package Reference: 1367073-1; Package Description: Female Connector, Pitch 0.8 mm, 2 x 10 Position, Height 5.4 mm; RoHS Information: 1367073-1StatementofCompliance; Contact Finish: Gold; Datasheet URL: http://www.te.com/commerce/DocumentDelivery/DDEController?Action=showdoc&DocId=Customer+Drawing%7F1367073%7FK%7Fpdf%7FEnglish%7FENG_CD_1367073_K.pdf%7F1367073-1; Datasheet Version: Rev. K, 12/2012; Contact Finish Thickness: 15µin(0.38µm); Category: Connectors,Interconnects; Mounting Type: SurfaceMount,RightAngle; Mounting Technology: SurfaceMount; Packaging: Digi-Reel®; Manufacturer URL: http://www.te.com/; Family: PluggableConnectors; Standard Package: 1; Termination: Solder
J5 = U77A461M2081: MF: AMPHENOL ICC / FCI; Package: None; Price: None; Value: *; MP: U77A461M2081; Availability: Unavailable
R2-R6 R8 R10-R13 R16 R17 R165 R166 = CMP-2002-05217-1: as R22 on sheet 01-PCIe
R64 R86 R174 R175 R186 R188 R194 R195 = CMP-2002-07574-1: Manufacturer: Yageo; Part Number: RC0402FR-072K67L
R113 R116 R132 R135 R177-R180 = CMP-2002-07853-1: Manufacturer: Yageo; Part Number: RC0402FR-13100RL
R146 R147 R189 R190 = CMP-2002-04569-1: as R23 on sheet 01-PCIe
R163 R164 R192 R193 = CMP-2002-04448-1: as R145 on sheet 01-PCIe
R176 R191 = CMP-2002-08434-1: Part Number: CRCW040227R0FKED; Manufacturer: Vishay Dale

## Sheet 06-Front Panel SFP_2.SchDoc
size B; SheetNumber: 5; SheetTotal: 15
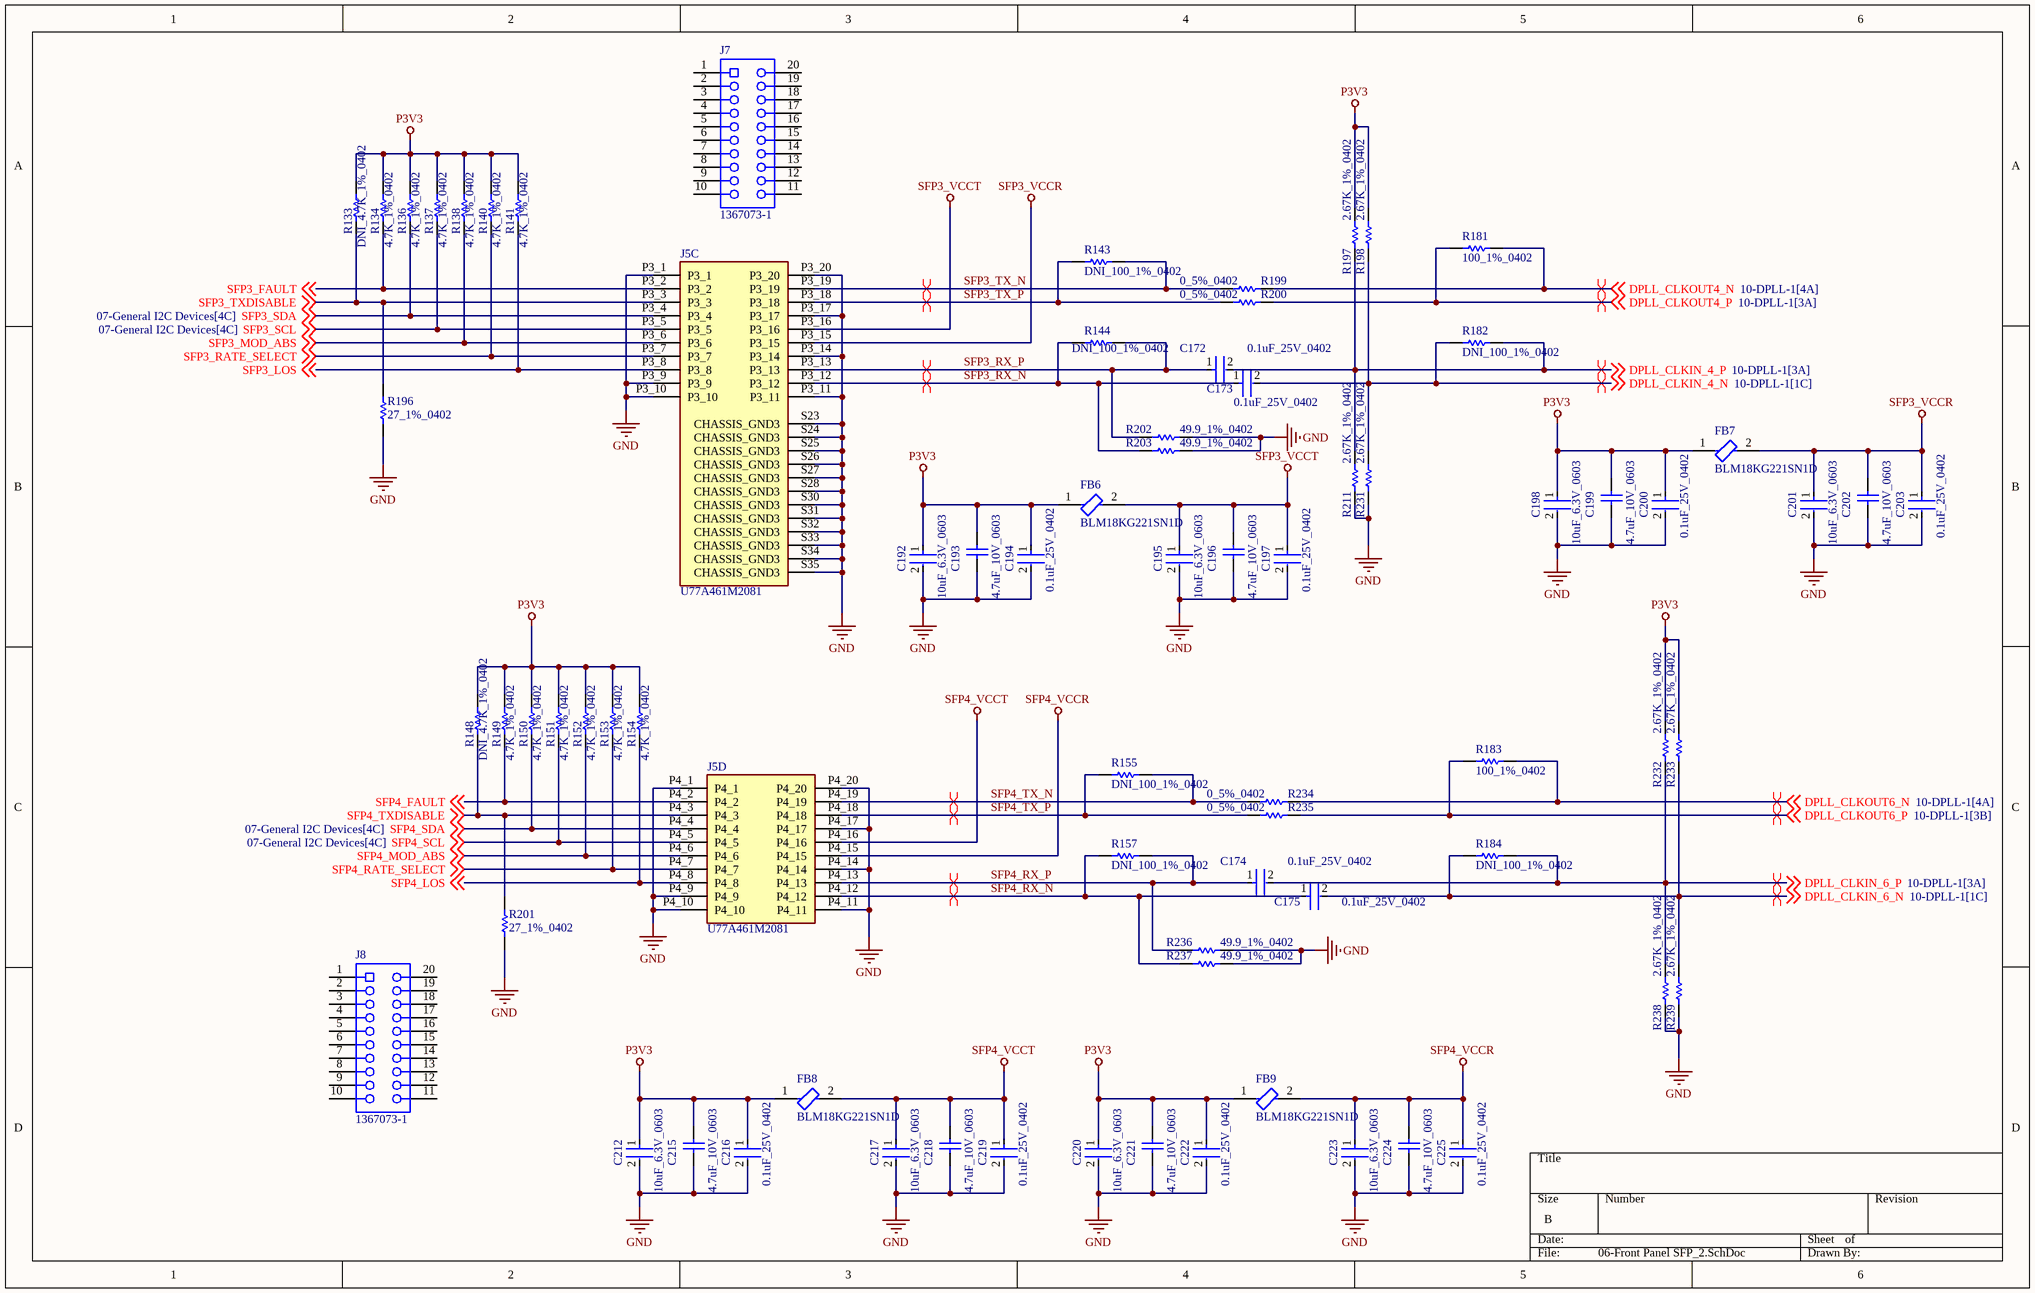
[diagram p4: 06-Front Panel SFP_2.SchDoc]

### Parts
C172  0.1uF_25V_0402  [FP-0402-L_1_0_1-W_0_5_0_1-IPC_C]
C173  0.1uF_25V_0402  [FP-0402-L_1_0_1-W_0_5_0_1-IPC_C]
C174  0.1uF_25V_0402  [FP-0402-L_1_0_1-W_0_5_0_1-IPC_C]
C175  0.1uF_25V_0402  [FP-0402-L_1_0_1-W_0_5_0_1-IPC_C]
C192  10uF_6.3V_0603  [FP-C0603C106M9PACTU-MFG]
C193  4.7uF_10V_0603  [CAPC1608X87X35NL15T15]
C194  0.1uF_25V_0402  [FP-0402-L_1_0_1-W_0_5_0_1-IPC_C]
C195  10uF_6.3V_0603  [FP-C0603C106M9PACTU-MFG]
C196  4.7uF_10V_0603  [CAPC1608X87X35NL15T15]
C197  0.1uF_25V_0402  [FP-0402-L_1_0_1-W_0_5_0_1-IPC_C]
C198  10uF_6.3V_0603  [FP-C0603C106M9PACTU-MFG]
C199  4.7uF_10V_0603  [CAPC1608X87X35NL15T15]
C200  0.1uF_25V_0402  [FP-0402-L_1_0_1-W_0_5_0_1-IPC_C]
C201  10uF_6.3V_0603  [FP-C0603C106M9PACTU-MFG]
C202  4.7uF_10V_0603  [CAPC1608X87X35NL15T15]
C203  0.1uF_25V_0402  [FP-0402-L_1_0_1-W_0_5_0_1-IPC_C]
C212  10uF_6.3V_0603  [FP-C0603C106M9PACTU-MFG]
C215  4.7uF_10V_0603  [CAPC1608X87X35NL15T15]
C216  0.1uF_25V_0402  [FP-0402-L_1_0_1-W_0_5_0_1-IPC_C]
C217  10uF_6.3V_0603  [FP-C0603C106M9PACTU-MFG]
C218  4.7uF_10V_0603  [CAPC1608X87X35NL15T15]
C219  0.1uF_25V_0402  [FP-0402-L_1_0_1-W_0_5_0_1-IPC_C]
C220  10uF_6.3V_0603  [FP-C0603C106M9PACTU-MFG]
C221  4.7uF_10V_0603  [CAPC1608X87X35NL15T15]
C222  0.1uF_25V_0402  [FP-0402-L_1_0_1-W_0_5_0_1-IPC_C]
C223  10uF_6.3V_0603  [FP-C0603C106M9PACTU-MFG]
C224  4.7uF_10V_0603  [CAPC1608X87X35NL15T15]
C225  0.1uF_25V_0402  [FP-0402-L_1_0_1-W_0_5_0_1-IPC_C]
FB6  BLM18KG221SN1D  [FP-BLM18-0_15-t0_8-IPC_B]
FB7  BLM18KG221SN1D  [FP-BLM18-0_15-t0_8-IPC_B]
FB8  BLM18KG221SN1D  [FP-BLM18-0_15-t0_8-IPC_B]
FB9  BLM18KG221SN1D  [FP-BLM18-0_15-t0_8-IPC_B]
J5  U77A461M2081  [AMPHENOL_U77A461M2081]  (parts C,D of 4)
J7  1367073-1  [TECO-1367073-1_V]
J8  1367073-1  [TECO-1367073-1_V]
R133  DNI_4.7K_1%_0402  [RESC1005X40X25NL10T10]  (no BOM)
R134  4.7K_1%_0402  [RESC1005X40X25NL10T10]
R136  4.7K_1%_0402  [RESC1005X40X25NL10T10]
R137  4.7K_1%_0402  [RESC1005X40X25NL10T10]
R138  4.7K_1%_0402  [RESC1005X40X25NL10T10]
R140  4.7K_1%_0402  [RESC1005X40X25NL10T10]
R141  4.7K_1%_0402  [RESC1005X40X25NL10T10]
R143  DNI_100_1%_0402  [RESC1005X40X25NL05T10]  (no BOM)
R144  DNI_100_1%_0402  [RESC1005X40X25NL05T10]  (no BOM)
R148  DNI_4.7K_1%_0402  [RESC1005X40X25NL10T10]  (no BOM)
R149  4.7K_1%_0402  [RESC1005X40X25NL10T10]
R150  4.7K_1%_0402  [RESC1005X40X25NL10T10]
R151  4.7K_1%_0402  [RESC1005X40X25NL10T10]
R152  4.7K_1%_0402  [RESC1005X40X25NL10T10]
R153  4.7K_1%_0402  [RESC1005X40X25NL10T10]
R154  4.7K_1%_0402  [RESC1005X40X25NL10T10]
R155  DNI_100_1%_0402  [RESC1005X40X25NL05T10]  (no BOM)
R157  DNI_100_1%_0402  [RESC1005X40X25NL05T10]  (no BOM)
R181  100_1%_0402  [RESC1005X40X25NL05T10]
R182  DNI_100_1%_0402  [RESC1005X40X25NL05T10]  (no BOM)
R183  100_1%_0402  [RESC1005X40X25NL05T10]
R184  DNI_100_1%_0402  [RESC1005X40X25NL05T10]  (no BOM)
R196  27_1%_0402  [RESC1005X40X25NL05T05]
R197  2.67K_1%_0402  [RESC1005X40X25NL05T10]
R198  2.67K_1%_0402  [RESC1005X40X25NL05T10]
R199  0_5%_0402  [RESC1005X40X25LL10T10]
R200  0_5%_0402  [RESC1005X40X25LL10T10]
R201  27_1%_0402  [RESC1005X40X25NL05T05]
R202  49.9_1%_0402  [RESC1005X40X25NL10T10]
R203  49.9_1%_0402  [RESC1005X40X25NL10T10]
R211  2.67K_1%_0402  [RESC1005X40X25NL05T10]
R231  2.67K_1%_0402  [RESC1005X40X25NL05T10]
R232  2.67K_1%_0402  [RESC1005X40X25NL05T10]
R233  2.67K_1%_0402  [RESC1005X40X25NL05T10]
R234  0_5%_0402  [RESC1005X40X25LL10T10]
R235  0_5%_0402  [RESC1005X40X25LL10T10]
R236  49.9_1%_0402  [RESC1005X40X25NL10T10]
R237  49.9_1%_0402  [RESC1005X40X25NL10T10]
R238  2.67K_1%_0402  [RESC1005X40X25NL05T10]
R239  2.67K_1%_0402  [RESC1005X40X25NL05T10]

### Nets
GND: C192.2 C193.1 C194.2 C195.2 C196.1 C197.2 C198.2 C199.1 C200.2 C201.2 C202.1 C203.2 C212.2 C215.1 C216.2 C217.2 C218.1 C219.2 C220.2 C221.1 C222.2 C223.2 C224.1 C225.2 J5.P3_1 J5.P3_9 J5.P3_10 J5.P3_11 J5.P3_14 J5.P3_17 J5.P3_20 J5.P4_1 J5.P4_9 J5.P4_10 J5.P4_11 J5.P4_14 J5.P4_17 J5.P4_20 J5.S23(CHASSIS_GND3) J5.S24(CHASSIS_GND3) J5.S25(CHASSIS_GND3) J5.S26(CHASSIS_GND3) J5.S27(CHASSIS_GND3) J5.S28(CHASSIS_GND3) J5.S30(CHASSIS_GND3) J5.S31(CHASSIS_GND3) J5.S32(CHASSIS_GND3) J5.S33(CHASSIS_GND3) J5.S34(CHASSIS_GND3) J5.S35(CHASSIS_GND3) R196.1 R201.1 R202.2 R203.2 R211.1 R231.1 R236.2 R237.2 R238.1 R239.1
P3V3: C192.1 C193.2 C194.1 C198.1 C199.2 C200.1 C212.1 C215.2 C216.1 C220.1 C221.2 C222.1 FB6.1 FB7.1 FB8.1 FB9.1 R133.1 R134.1 R136.1 R137.1 R138.1 R140.1 R141.1 R148.1 R149.1 R150.1 R151.1 R152.1 R153.1 R154.1 R197.2 R198.2 R232.2 R233.2
SFP3_VCCR: C201.1 C202.2 C203.1 FB7.2 J5.P3_15
SFP3_VCCT: C195.1 C196.2 C197.1 FB6.2 J5.P3_16
SFP4_VCCR: C223.1 C224.2 C225.1 FB9.2 J5.P4_15
SFP4_VCCT: C217.1 C218.2 C219.1 FB8.2 J5.P4_16
DPLL_CLKIN_4_N: C173.2 R182.1 R198.1 R231.2 ; off-sheet DPLL_CLKIN_4_N
DPLL_CLKIN_4_P: C172.2 R182.2 R197.1 R211.2 ; off-sheet DPLL_CLKIN_4_P
DPLL_CLKIN_6_N: C175.2 R184.1 R233.1 R239.2 ; off-sheet DPLL_CLKIN_6_N
DPLL_CLKIN_6_P: C174.2 R184.2 R232.1 R238.2 ; off-sheet DPLL_CLKIN_6_P
DPLL_CLKOUT4_N: R181.2 R199.2 ; off-sheet DPLL_CLKOUT4_N
DPLL_CLKOUT4_P: R181.1 R200.2 ; off-sheet DPLL_CLKOUT4_P
DPLL_CLKOUT6_N: R183.2 R234.2 ; off-sheet DPLL_CLKOUT6_N
DPLL_CLKOUT6_P: R183.1 R235.2 ; off-sheet DPLL_CLKOUT6_P
SFP3_FAULT: J5.P3_2 R134.2 ; off-sheet SFP3_FAULT
SFP3_LOS: J5.P3_8 R141.2 ; off-sheet SFP3_LOS
SFP3_MOD_ABS: J5.P3_6 R138.2 ; off-sheet SFP3_MOD_ABS
SFP3_RATE_SELECT: J5.P3_7 R140.2 ; off-sheet SFP3_RATE_SELECT
SFP3_RX_N: C173.1 J5.P3_12 R144.1 R203.1
SFP3_RX_P: C172.1 J5.P3_13 R144.2 R202.1
SFP3_SCL: J5.P3_5 R137.2 ; off-sheet SFP3_SCL
SFP3_SDA: J5.P3_4 R136.2 ; off-sheet SFP3_SDA
SFP3_TX_N: J5.P3_19 R143.2 R199.1
SFP3_TX_P: J5.P3_18 R143.1 R200.1
SFP3_TXDISABLE: J5.P3_3 R133.2 R196.2 ; off-sheet SFP3_TXDISABLE
SFP4_FAULT: J5.P4_2 R149.2 ; off-sheet SFP4_FAULT
SFP4_LOS: J5.P4_8 R154.2 ; off-sheet SFP4_LOS
SFP4_MOD_ABS: J5.P4_6 R152.2 ; off-sheet SFP4_MOD_ABS
SFP4_RATE_SELECT: J5.P4_7 R153.2 ; off-sheet SFP4_RATE_SELECT
SFP4_RX_N: C175.1 J5.P4_12 R157.1 R237.1
SFP4_RX_P: C174.1 J5.P4_13 R157.2 R236.1
SFP4_SCL: J5.P4_5 R151.2 ; off-sheet SFP4_SCL
SFP4_SDA: J5.P4_4 R150.2 ; off-sheet SFP4_SDA
SFP4_TX_N: J5.P4_19 R155.2 R234.1
SFP4_TX_P: J5.P4_18 R155.1 R235.1
SFP4_TXDISABLE: J5.P4_3 R148.2 R201.2 ; off-sheet SFP4_TXDISABLE

Not connected (* = marked no-connect by the designer): J7 1 2 3 4 5 6 7 8 9 10 11 12 13 14 15 16 17 18 19 20; J8 1 2 3 4 5 6 7 8 9 10 11 12 13 14 15 16 17 18 19 20

### Layout directives
differential pair: DPLL_CLKIN_4_N, DPLL_CLKIN_4_P, DPLL_CLKIN_6_N, DPLL_CLKIN_6_P, DPLL_CLKOUT4_N, DPLL_CLKOUT4_P, DPLL_CLKOUT6_N, DPLL_CLKOUT6_P, SFP3_RX_N, SFP3_RX_P, SFP3_TX_N, SFP3_TX_P, SFP4_RX_N, SFP4_RX_P, SFP4_TX_N, SFP4_TX_P

### Library data of the parts
C172-C175 C194 C197 C200 C203 C216 C219 C222 C225 = CMP-2008-02519-2: as C44 on sheet 01-PCIe; Package Quantity: 1; Capacitance: 100nF; Min Operating Temperature: -55°C; Voltage: 25V; Voltage Rating: 25V; Construction: Flat; Max Operating Temperature: 125°C; Radiation Hardening: No; Depth: 0.5mm; Thickness: 0.022inch; Voltage Rating (DC): 25V; Number of Pins: 2; Lead Free: Lead Free; Series: -; REACH SVHC: No SVHC; Length: 1mm; Dielectric: X7R; RoHS Compliant: Yes; Mount: Surface Mount; Packaging: Tape and Reel; Case/Package: 0402; Case Code (Imperial): 0402; Termination: SMD/SMT; Width: 0.02inch; Case Code (Metric): 1005; Tolerance: 10%
C192 C195 C198 C201 C212 C217 C220 C223 = CMP-2006-02285-3: as C5 on sheet 05-Front Panel SFP_1; Category: Cap; Height: 0.9mm; Digikey Description: CAP CER 10UF 6.3V X5R 0603; Mouser Description: In a Pack of 10, KEMET 0603 (1608M) 10µF MLCC 6.3V dc ±20% SMD C0603C106M9PACTU; Voltage Rating: 6.3V; Device Class L2: Capacitors; Temperature Range Low: -55°C; Temperature Characteristic: X5R; ComponentLink2Description: Datasheet; Ipc Land Pattern Name: CAPC16080X80; ComponentLink2URL: http://www.kemet.com/Lists/ProductCatalog/Attachments/19/KEM_C1006_X5R_SMD.pdf; Capacitance: 10uF; Temperature Range High: +85°C; Device Class L3: Ceramic Capacitors; RoHS: TRUE; Automotive: No; Value: 10uF; Temperature: -55°C to +85°C; Device Class L1: Passive Components; Package: C0603C106M9PACTU; Lead Free: Yes; Octopart: https://octopart.com/c0603c106m9pactu-kemet-8375727
C193 C196 C199 C202 C215 C218 C221 C224 = CMP-2006-03238-1: as C6 on sheet 05-Front Panel SFP_1
FB6-FB9 = CMP-0686-00556-7: as FB1 on sheet 05-Front Panel SFP_1; Current Rating: 2.2A; Material: Ferrite; Test Frequency: 100MHz; Depth: 0.8mm; Series: BLM18K; RoHS Compliant: Yes; Termination: SMD/SMT; Max Current Rating: 2.2A; Case Code (Metric): 1608; Radiation Hardening: No; Number of Pins: 2; Length: 1.6mm; Lead Free: Lead Free; Package Quantity: 1; Height: 0.8mm; Core Material: Ferrite; Inductor Type: FERRITE BEAD; Min Operating Temperature: -55°C; Case/Package: 0603; Case Code (Imperial): 0603; Number of Lines: 1; Packaging: Tape and Reel; REACH SVHC: No SVHC; Max Operating Temperature: 125°C; Military Standard: Not; DC Resistance-Max: 50mR; Width: 0.8mm; DC Current: 2.2A; Max DC Current: 2.2A; Tolerance: 25%; Weight: 7.1E-05oz
J5 = U77A461M2081: MF: AMPHENOL ICC / FCI; Package: None; Price: None; Value: *; MP: U77A461M2081; Availability: Unavailable
J7 J8 = CMP-2000-05488-1: as J1 on sheet 05-Front Panel SFP_1; Package Reference: 1367073-1; Package Description: Female Connector, Pitch 0.8 mm, 2 x 10 Position, Height 5.4 mm; RoHS Information: 1367073-1StatementofCompliance; Contact Finish: Gold; Datasheet URL: http://www.te.com/commerce/DocumentDelivery/DDEController?Action=showdoc&DocId=Customer+Drawing%7F1367073%7FK%7Fpdf%7FEnglish%7FENG_CD_1367073_K.pdf%7F1367073-1; Datasheet Version: Rev. K, 12/2012; Contact Finish Thickness: 15µin(0.38µm); Category: Connectors,Interconnects; Mounting Type: SurfaceMount,RightAngle; Mounting Technology: SurfaceMount; Packaging: Digi-Reel®; Manufacturer URL: http://www.te.com/; Family: PluggableConnectors; Standard Package: 1; Termination: Solder
R133 R134 R136-R138 R140 R141 R148-R154 = CMP-2002-05217-1: as R22 on sheet 01-PCIe
R143 R144 R155 R157 R181-R184 = CMP-2002-07853-1: as R113 on sheet 05-Front Panel SFP_1
R196 R201 = CMP-2002-08434-1: as R176 on sheet 05-Front Panel SFP_1
R197 R198 R211 R231-R233 R238 R239 = CMP-2002-07574-1: as R64 on sheet 05-Front Panel SFP_1
R199 R200 R234 R235 = CMP-2002-04569-1: as R23 on sheet 01-PCIe
R202 R203 R236 R237 = CMP-2002-04448-1: as R145 on sheet 01-PCIe

## Sheet 07-General I2C Devices.SchDoc
size A3; SheetNumber: 6; SheetTotal: 15
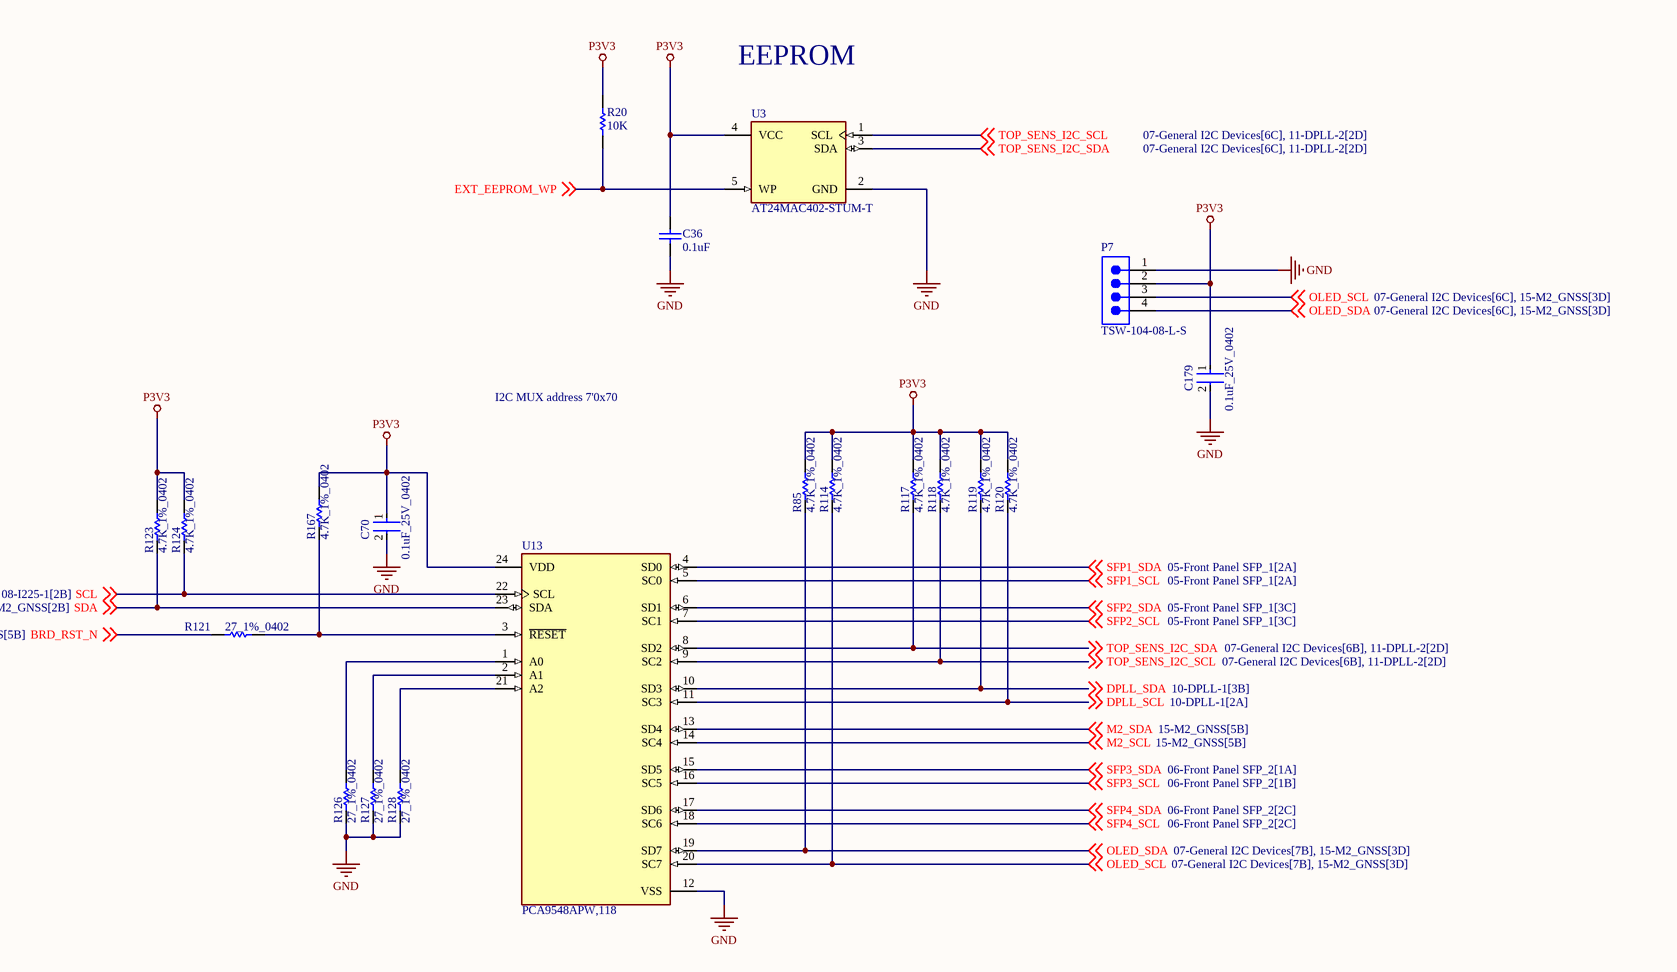
[diagram p5: 07-General I2C Devices.SchDoc]

### Parts
C36  0.1uF  [CAPC1608X87X45ML20T05]
C70  0.1uF_25V_0402  [FP-0402-L_1_0_1-W_0_5_0_1-IPC_C]
C179  0.1uF_25V_0402  [FP-0402-L_1_0_1-W_0_5_0_1-IPC_C]
P7  TSW-104-08-L-S  [SMTC-TSW-104-08-X-S]
R20  10K  [RESC1608X55X30LL15T20]
R85  4.7K_1%_0402  [RESC1005X40X25NL10T10]
R114  4.7K_1%_0402  [RESC1005X40X25NL10T10]
R117  4.7K_1%_0402  [RESC1005X40X25NL10T10]
R118  4.7K_1%_0402  [RESC1005X40X25NL10T10]
R119  4.7K_1%_0402  [RESC1005X40X25NL10T10]
R120  4.7K_1%_0402  [RESC1005X40X25NL10T10]
R121  27_1%_0402  [RESC1005X40X25NL05T05]
R123  4.7K_1%_0402  [RESC1005X40X25NL10T10]
R124  4.7K_1%_0402  [RESC1005X40X25NL10T10]
R126  27_1%_0402  [RESC1005X40X25NL05T05]
R127  27_1%_0402  [RESC1005X40X25NL05T05]
R128  27_1%_0402  [RESC1005X40X25NL05T05]
R167  4.7K_1%_0402  [RESC1005X40X25NL10T10]
U3  AT24MAC402-STUM-T  [FP-5TS1-IPC_C]
U13  PCA9548APW,118  [FP-SOT355-1-MFG]

### Nets
GND: C36.1 C70.2 C179.2 P7.1 R126.1 R127.1 R128.1 U3.2(GND) U13.12(VSS)
P3V3: C36.2 C70.1 C179.1 P7.2 R20.2 R85.2 R114.2 R117.2 R118.2 R119.2 R120.2 R123.2 R124.2 R167.2 U3.4(VCC) U13.24(VDD)
BRD_RST_N: R121.1 ; off-sheet BRD_RST_N
DPLL_SCL: R120.1 U13.11(SC3) ; off-sheet DPLL_SCL
DPLL_SDA: R119.1 U13.10(SD3) ; off-sheet DPLL_SDA
EXT_EEPROM_WP: R20.1 U3.5(WP) ; off-sheet EXT_EEPROM_WP
M2_SCL: U13.14(SC4) ; off-sheet M2_SCL
M2_SDA: U13.13(SD4) ; off-sheet M2_SDA
OLED_SCL: P7.3 R114.1 U13.20(SC7) ; off-sheet OLED_SCL
OLED_SDA: P7.4 R85.1 U13.19(SD7) ; off-sheet OLED_SDA
SCL: R124.1 U13.22(SCL) ; off-sheet SCL
SDA: R123.1 U13.23(SDA) ; off-sheet SDA
SFP1_SCL: U13.5(SC0) ; off-sheet SFP1_SCL
SFP1_SDA: U13.4(SD0) ; off-sheet SFP1_SDA
SFP2_SCL: U13.7(SC1) ; off-sheet SFP2_SCL
SFP2_SDA: U13.6(SD1) ; off-sheet SFP2_SDA
SFP3_SCL: U13.16(SC5) ; off-sheet SFP3_SCL
SFP3_SDA: U13.15(SD5) ; off-sheet SFP3_SDA
SFP4_SCL: U13.18(SC6) ; off-sheet SFP4_SCL
SFP4_SDA: U13.17(SD6) ; off-sheet SFP4_SDA
TOP_SENS_I2C_SCL: R118.1 U3.1(SCL) U13.9(SC2) ; off-sheet TOP_SENS_I2C_SCL
TOP_SENS_I2C_SDA: R117.1 U3.3(SDA) U13.8(SD2) ; off-sheet TOP_SENS_I2C_SDA
NetR121_2: R121.2 R167.1 U13.3(~{RESET})
NetR126_2: R126.2 U13.1(A0)
NetR127_2: R127.2 U13.2(A1)
NetR128_2: R128.2 U13.21(A2)

### Notes on the sheet
- EEPROM
- I2C MUX address 7'0x70

### Library data of the parts
C36 = CMP-2006-00003-1: C0603X104K5RACAUTO; Manufacturer: Kemet; Part Number: C0603X104K5RACAUTO
C70 C179 = CMP-2008-02519-2: as C44 on sheet 01-PCIe; Package Quantity: 1; Capacitance: 100nF; Min Operating Temperature: -55°C; Voltage: 25V; Voltage Rating: 25V; Construction: Flat; Max Operating Temperature: 125°C; Radiation Hardening: No; Depth: 0.5mm; Thickness: 0.022inch; Voltage Rating (DC): 25V; Number of Pins: 2; Lead Free: Lead Free; Series: -; REACH SVHC: No SVHC; Length: 1mm; Dielectric: X7R; RoHS Compliant: Yes; Mount: Surface Mount; Packaging: Tape and Reel; Case/Package: 0402; Case Code (Imperial): 0402; Termination: SMD/SMT; Width: 0.02inch; Case Code (Metric): 1005; Tolerance: 10%
P7 = CMP-1024-00358-1: 0.025" SQ Post Header, Through-hole, Vertical, -55 to 125 degC, 2.54 mm Pitch, 4-Pin, Male, RoHS; Manufacturer: Samtec; Pitch: 2.54 mm; PartNumber: TSW-104-08-L-S; RoHS: True; Temperature Range: -55 to 125 degC; PackageDescription: .025[0.64] SQ. Post Terminal Strip Assembly; Orientation: Vertical; ComponentLink2URL: http://www.samtec.com/documents/webfiles/pdf/TSW_TH.PDF; ComponentLink1Description: Manufacturer URL; ComponentLink2Description: Datasheet; PackageVersion: DM, 8/1988; ComponentLink3URL: http://www.samtec.com/documents/webfiles/cpdf/TSW-XXX-XX-XXX-X-XX-XXX-MKT.pdf; Mounting Technology: Through-hole; PackageReference: TSW-104-08-X-S; ComponentLink3Description: Package Specification; ComponentLink1URL: http://www.samtec.com; DatasheetVersion: F-214
R20 = CMP-2000-06990-1: Chip Resistor, 10 KOhm, +/- 1%, 0.1 W, -55 to 155 degC, 0603 (1608 Metric), RoHS, Tape and Reel RMCF0603FT10K0; Manufacturer: Stackpole-Electronics-Inc.; Temperature Coefficient: ±100ppm/°C; Power (Watts): 0.1W,1/10W; Package / Case: 0603(1608Metric); Datasheet Version: 01/2017; Resistance (Ohms): 10k; Features: AutomotiveAEC-Q200; Packaging: CutTape(CT); Series: RMCF; Height: 0.022"(0.55mm); Tolerance: ±1%; Manufacturer URL: https://www.seielect.com/; Datasheet URL: https://www.seielect.com/Catalog/SEI-RMCF_RMCP.pdf; Supplier Device Package: 0603; Number of Terminations: 2; Family: ChipResistor-SurfaceMount; Package Reference: 0603; Size / Dimension: 0.061"Lx0.031"W(1.55mmx0.80mm); Mounting Technology: SurfaceMount; Package Description: 2-Pin Surface Mount Device, Body 1.55 x 0.8 mm; Operating Temperature: -55°C~155°C; Composition: ThickFilm; Category: Resistors
R85 R114 R117-R120 R123 R124 R167 = CMP-2002-05217-1: as R22 on sheet 01-PCIe
R121 R126-R128 = CMP-2002-08434-1: as R176 on sheet 05-Front Panel SFP_1
U3 = CMP-06313-000011-1: IC EEPROM 2K I2C 1MHZ SOT23-5; Manufacturer: Microchip; Memory Size: 2Kbits; Min Supply Voltage: 1.7V; Max Supply Voltage: 5.5V; Frequency: 1000kHz; Standoff Height: 0mm; Nominal Supply Current: 0.4-2mA; Access Time: 0.55us; Interface: I2C,2-Wire; Temperature Range Low: -40°C; Height: 1mm; ComponentLink2URL: http://ww1.microchip.com/downloads/en/DeviceDoc/Atmel-8807-SEEPROM-AT24MAC402-602-Datasheet.pdf; Ipc Land Pattern Name: SOT95P280X100-5; Category: IC; Memory Type: EEPROM; Digikey Description: IC EEPROM 2K I2C 1MHZ SOT23-5; Manufacturer Part Number: AT24MAC402-STUM-T; Device Class L1: Integrated Circuits (ICs); Temperature Range High: +85°C; ComponentLink2Description: Datasheet; RoHS: TRUE; Mouser Description: EEPROM Serial-I2C 2K-bit 256 x 8 1.8V/2.5V/3.3V/5V 5-Pin SOT-23 T/R; Octopart: https://octopart.com/at24mac402-stum-t-microchip-77758112; Temperature: -40°C to +85°C; Package: 5TS1; Device Class L3: EEPROM; Automotive: No; Device Class L2: Memory; Lead Free: Yes
U13 = CMP-2000-06880-2: IC INTERFACE SPECIALIZED 24TSSOP; Power Dissipation: 400mW; Low Level Output Current: 9mA; Number of Channels: 16; Max Frequency: 400kHz; Number of Inputs: 8; Number of Outputs: 1; On-State Resistance: 24R; Interface: I2C; Turn-On Delay Time: 300ns; Logic Function: Multiplexer; Nominal Supply Current: 100mA; Operating Supply Current: 65uA; Min Supply Voltage: 2.3V; Propagation Delay: 0.3ns; Max Supply Voltage: 5.5V; Contact Plating: Gold; Max Power Dissipation: 400mW; Mount: Surface Mount; Package Quantity: 2500; Min Operating Temperature: -40°C; Max Operating Temperature: 85°C; Case/Package: TSSOP; Number of Pins: 24; Bandwidth: 400kHz; Quiescent Current: 65uA; Packaging: Tape and Reel; Lead Free: Lead Free; Turn-Off Delay Time: 300ns; Radiation Hardening: No